# Altium project obc_ver2.PrjPcb (part 2 of 3)

## Sheet obc-v2_CM4-M2.SchDoc
size 420 x 297 mm; SheetNumber: 13; SheetTotal: 21
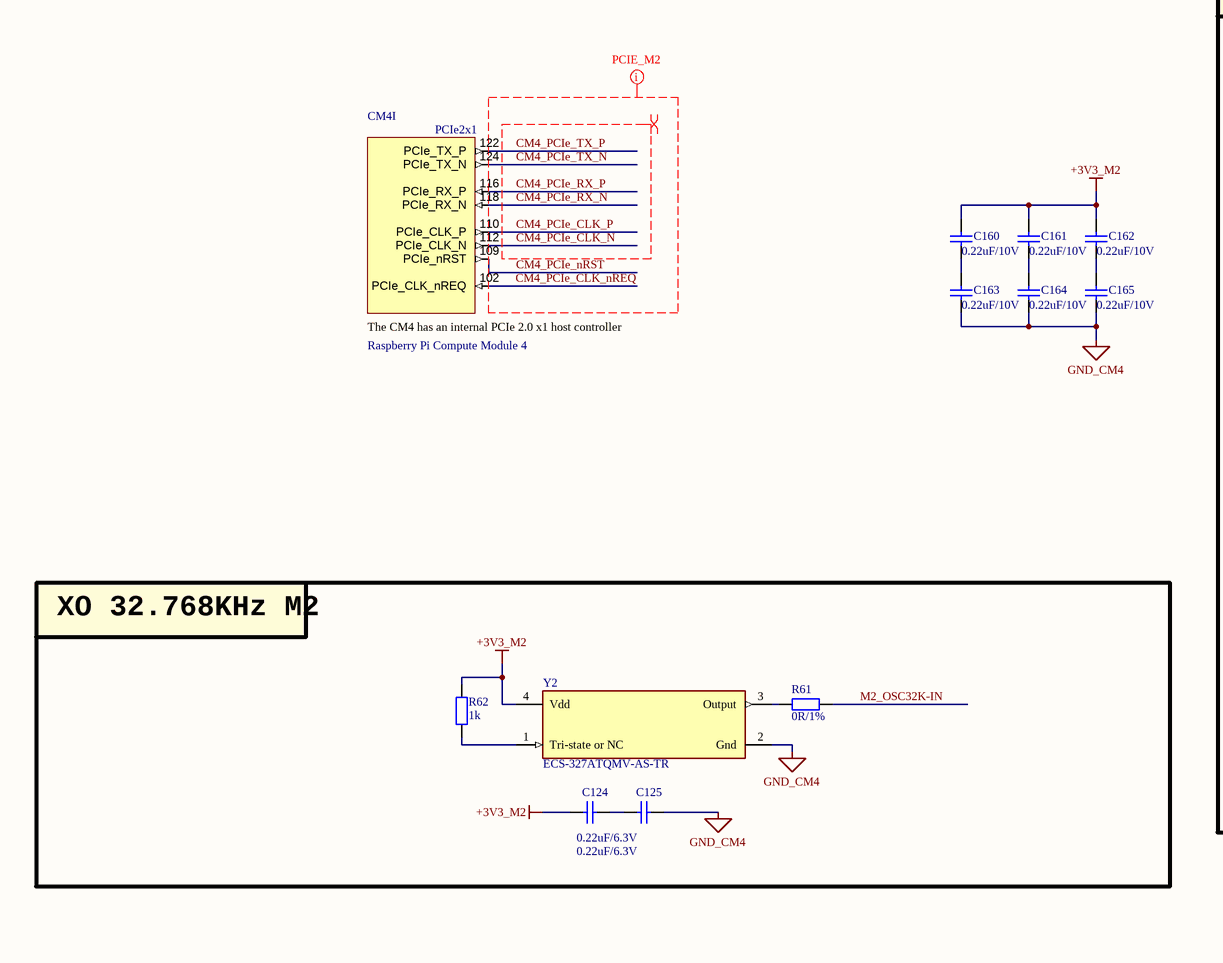
[diagram p13: obc-v2_CM4-M2.SchDoc, left]
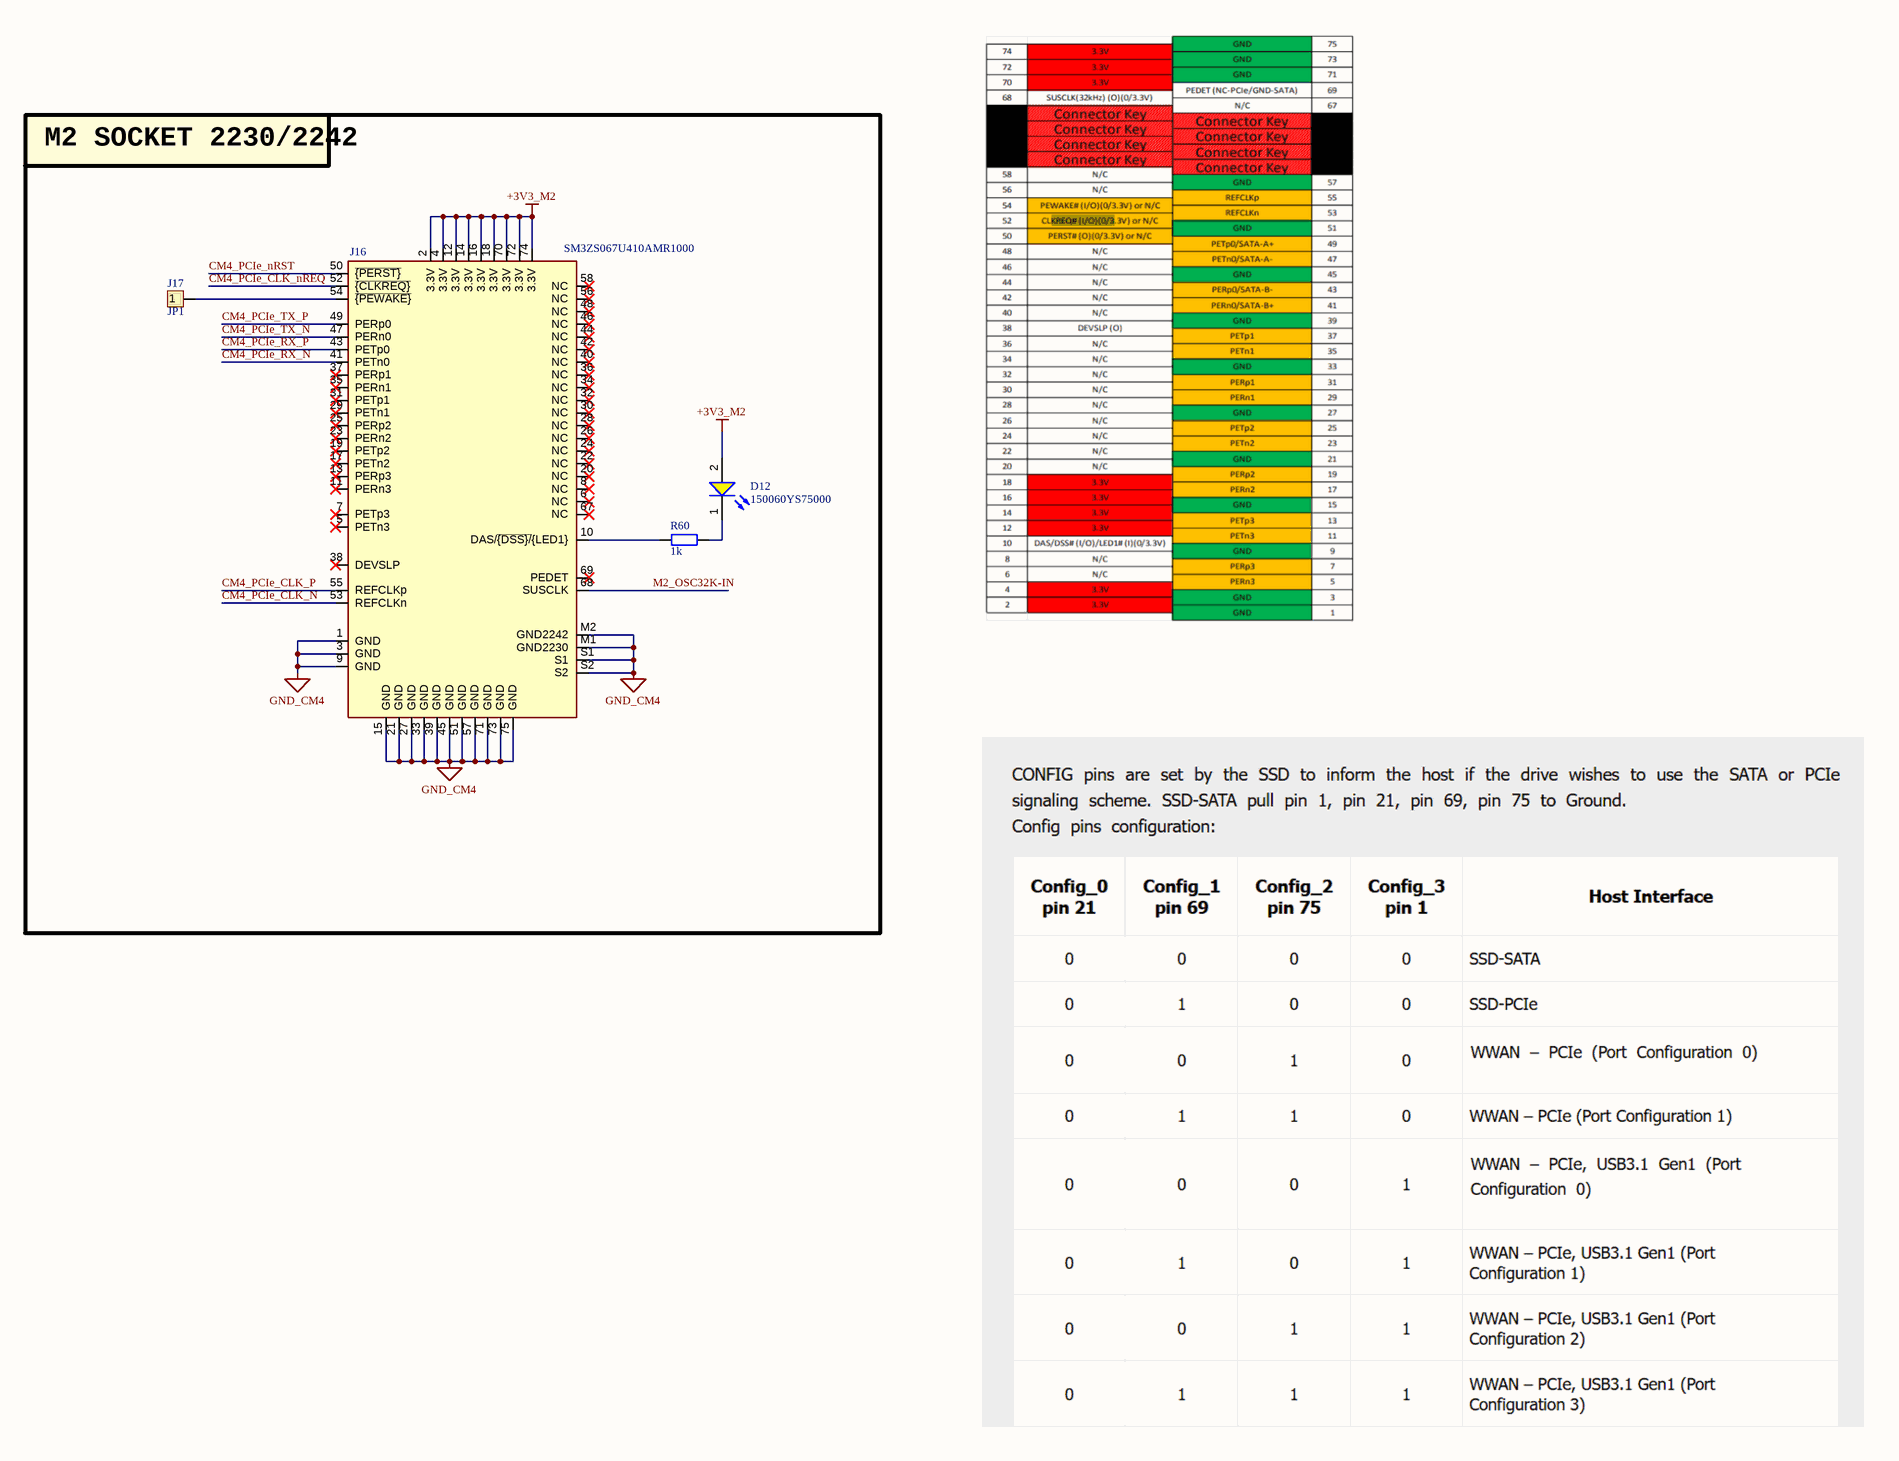
[diagram p14: obc-v2_CM4-M2.SchDoc, right]

### Parts
C124  0.22uF/6.3V  [CAP_C_1005X60]
C125  0.22uF/6.3V  [CAP_C_1005X60]
C160  0.22uF/10V  [CAP_C_1005X60]
C161  0.22uF/10V  [CAP_C_1005X60]
C162  0.22uF/10V  [CAP_C_1005X60]
C163  0.22uF/10V  [CAP_C_1005X60]
C164  0.22uF/10V  [CAP_C_1005X60]
C165  0.22uF/10V  [CAP_C_1005X60]
CM4  Raspberry Pi Compute Module 4  [CM4-DF40HC(3.0)-100DS-0.4v_3mm_1.5mm]  (part I of 21)  (no BOM)
D12  150060YS75000  [WL-SMCW_0603_150060xx75000]
J16  value SM3ZS067U410AMR1000  [M.2 M Key socket]  (hidden comment: Bus_M.2_Socket_M)
J17  JP1  [JP1-D1T]
R60  1k  [RES_C_1608X60]
R61  0R/1%  [RES_C_1608X60]
R62  1k  [RES_C_1608X60]
Y2  ECS-327ATQMV-AS-TR  [FP-327ATQMV-MFG]

### Blocks framed on the sheet
M2 SOCKET 2230/2242: D12 J16 J17 R60
XO 32.768KHz M2: C124 C125 R61 R62 Y2

### Nets
+3V3_M2: C124.1 C160.1 C161.1 C162.1 D12.2(A) J16.2(3.3V) J16.4(3.3V) J16.12(3.3V) J16.14(3.3V) J16.16(3.3V) J16.18(3.3V) J16.70(3.3V) J16.72(3.3V) J16.74(3.3V) R62.1 Y2.4(Vdd)
GND_CM4: C125.2 C163.2 C164.2 C165.2 J16.1(GND) J16.3(GND) J16.9(GND) J16.15(GND) J16.21(GND) J16.27(GND) J16.33(GND) J16.39(GND) J16.45(GND) J16.51(GND) J16.57(GND) J16.71(GND) J16.73(GND) J16.75(GND) J16.M1(GND2230) J16.M2(GND2242) J16.S1 J16.S2 Y2.2(Gnd)
CM4_PCIe_CLK_N: CM4.112(PCIe_CLK_N) J16.53(REFCLKn)
CM4_PCIe_CLK_nREQ: CM4.102(PCIe_CLK_nREQ) J16.52(~{{CLKREQ}})
CM4_PCIe_CLK_P: CM4.110(PCIe_CLK_P) J16.55(REFCLKp)
CM4_PCIe_nRST: CM4.109(PCIe_nRST) J16.50(~{{PERST}})
CM4_PCIe_RX_N: CM4.118(PCIe_RX_N) J16.41(PETn0)
CM4_PCIe_RX_P: CM4.116(PCIe_RX_P) J16.43(PETp0)
CM4_PCIe_TX_N: CM4.124(PCIe_TX_N) J16.47(PERn0)
CM4_PCIe_TX_P: CM4.122(PCIe_TX_P) J16.49(PERp0)
M2_OSC32K-IN: J16.68(SUSCLK) R61.1
NetC124_2: C124.2 C125.1
NetC160_2: C160.2 C163.1
NetC161_2: C161.2 C164.1
NetC162_2: C162.2 C165.1
NetD12_1: D12.1(K) R60.1
NetJ16_10: J16.10(DAS/~{{DSS}/}{LED1}) R60.2
NetJ16_54: J16.54(~{{PEWAKE}}) J17.1
NetR61_2: R61.2 Y2.3(Output)
NetR62_2: R62.2 Y2.1(Tri-state_or_NC)

Not connected (* = marked no-connect by the designer): J16 5(PETn3)* 6(NC)* 7(PETp3)* 8(NC)* 11(PERn3)* 13(PERp3)* 17(PETn2)* 19(PETp2)* 20(NC)* 22(NC)* 23(PERn2)* 24(NC)* 25(PERp2)* 26(NC)* 28(NC)* 29(PETn1)* 30(NC)* 31(PETp1)* 32(NC)* 34(NC)* 35(PERn1)* 36(NC)* 37(PERp1)* 38(DEVSLP)* 40(NC)* 42(NC)* 44(NC)* 46(NC)* 48(NC)* 56(NC)* 58(NC)* 67(NC)* 69(PEDET)*

### Layout directives
differential pair; differential pair class DIFF100: CM4_PCIe_CLK_N, CM4_PCIe_CLK_P, CM4_PCIe_RX_N, CM4_PCIe_RX_P, CM4_PCIe_TX_N, CM4_PCIe_TX_P
net class PCIE_M2: CM4_PCIe_CLK_N, CM4_PCIe_CLK_nREQ, CM4_PCIe_CLK_P, CM4_PCIe_nRST, CM4_PCIe_RX_N, CM4_PCIe_RX_P, CM4_PCIe_TX_N, CM4_PCIe_TX_P

### Notes on the sheet
- Project:
- Sub-system:
- Design by:
- Sheet title:
- Sheet
- A3
- of
- Checked by:
- Approved by:
- Revision:
- Document No:
- Size:
- Date:
- (in symbol CM4, part I) PCIe2x1; The CM4 has an internal PCIe 2.0 x1 host controller

### Library data of the parts
C124 C125 C160-C165 = Tu 0402 33nF 10V: as C1 on sheet obc-v2_POWER; Kieu_Chan: *
CM4 = CM4: Raspberry Pi Compute Module 4 by Amornthep Phunsin
D12 = CMP-1426-00005-2: as D1 on sheet obc-v2_POWER; Case Code (Imperial): 0603; Height: 700µm; REACH SVHC: Unknown; Dominant Wavelength: 590nm; Min Operating Temperature: -40°C; Color: Yellow; Width: 800µm; Mount: Surface Mount; Packaging: Tape and Reel; Max Operating Temperature: 85°C; RoHS: Compliant; Max Reverse Voltage (DC): 5V; Case Code (Metric): 1608; Length: 1.6mm; Case/Package: 0603
J16 = Bus_M.2_Socket_M: Part Description: M.2 M Key connector; Field5: MTSSD03-67MSW337; Field7: MTCONN; Field6: MTSSD03-67MSW337; Footprint: CM5IO:M.2 M Key socket
J17 = JP1: WR-PHD 2.54 mm Angled Socket Header; Manufacturer: W¨¹rth Elektronik eiSos GmbH; partNo: 613002143121; ComponentLink1 Description: Manufacturer; ComponentLink2 Description: Datasheet; NoPins: 02; Created Date: 29 March 2013; ComponentLink1URL: http://www.we-online.com; ComponentLink2URL: http://katalog.we-online.de/em/datasheet/6130xx143121.pdf; Created by: Karrer Zheng
R60-R62 = Tro 0603 1% 10k: as R1 on sheet obc-v2_POWER; Kieu_Chan: *
Y2 = CMP-40224-000027-1: XTAL OSC XO 32.7680KHZ CMOS SMD; RoHS Compliant: Yes

## Sheet obc-v2_CM4-PinOut.SchDoc
size 420 x 297 mm; SheetNumber: 14; SheetTotal: 21
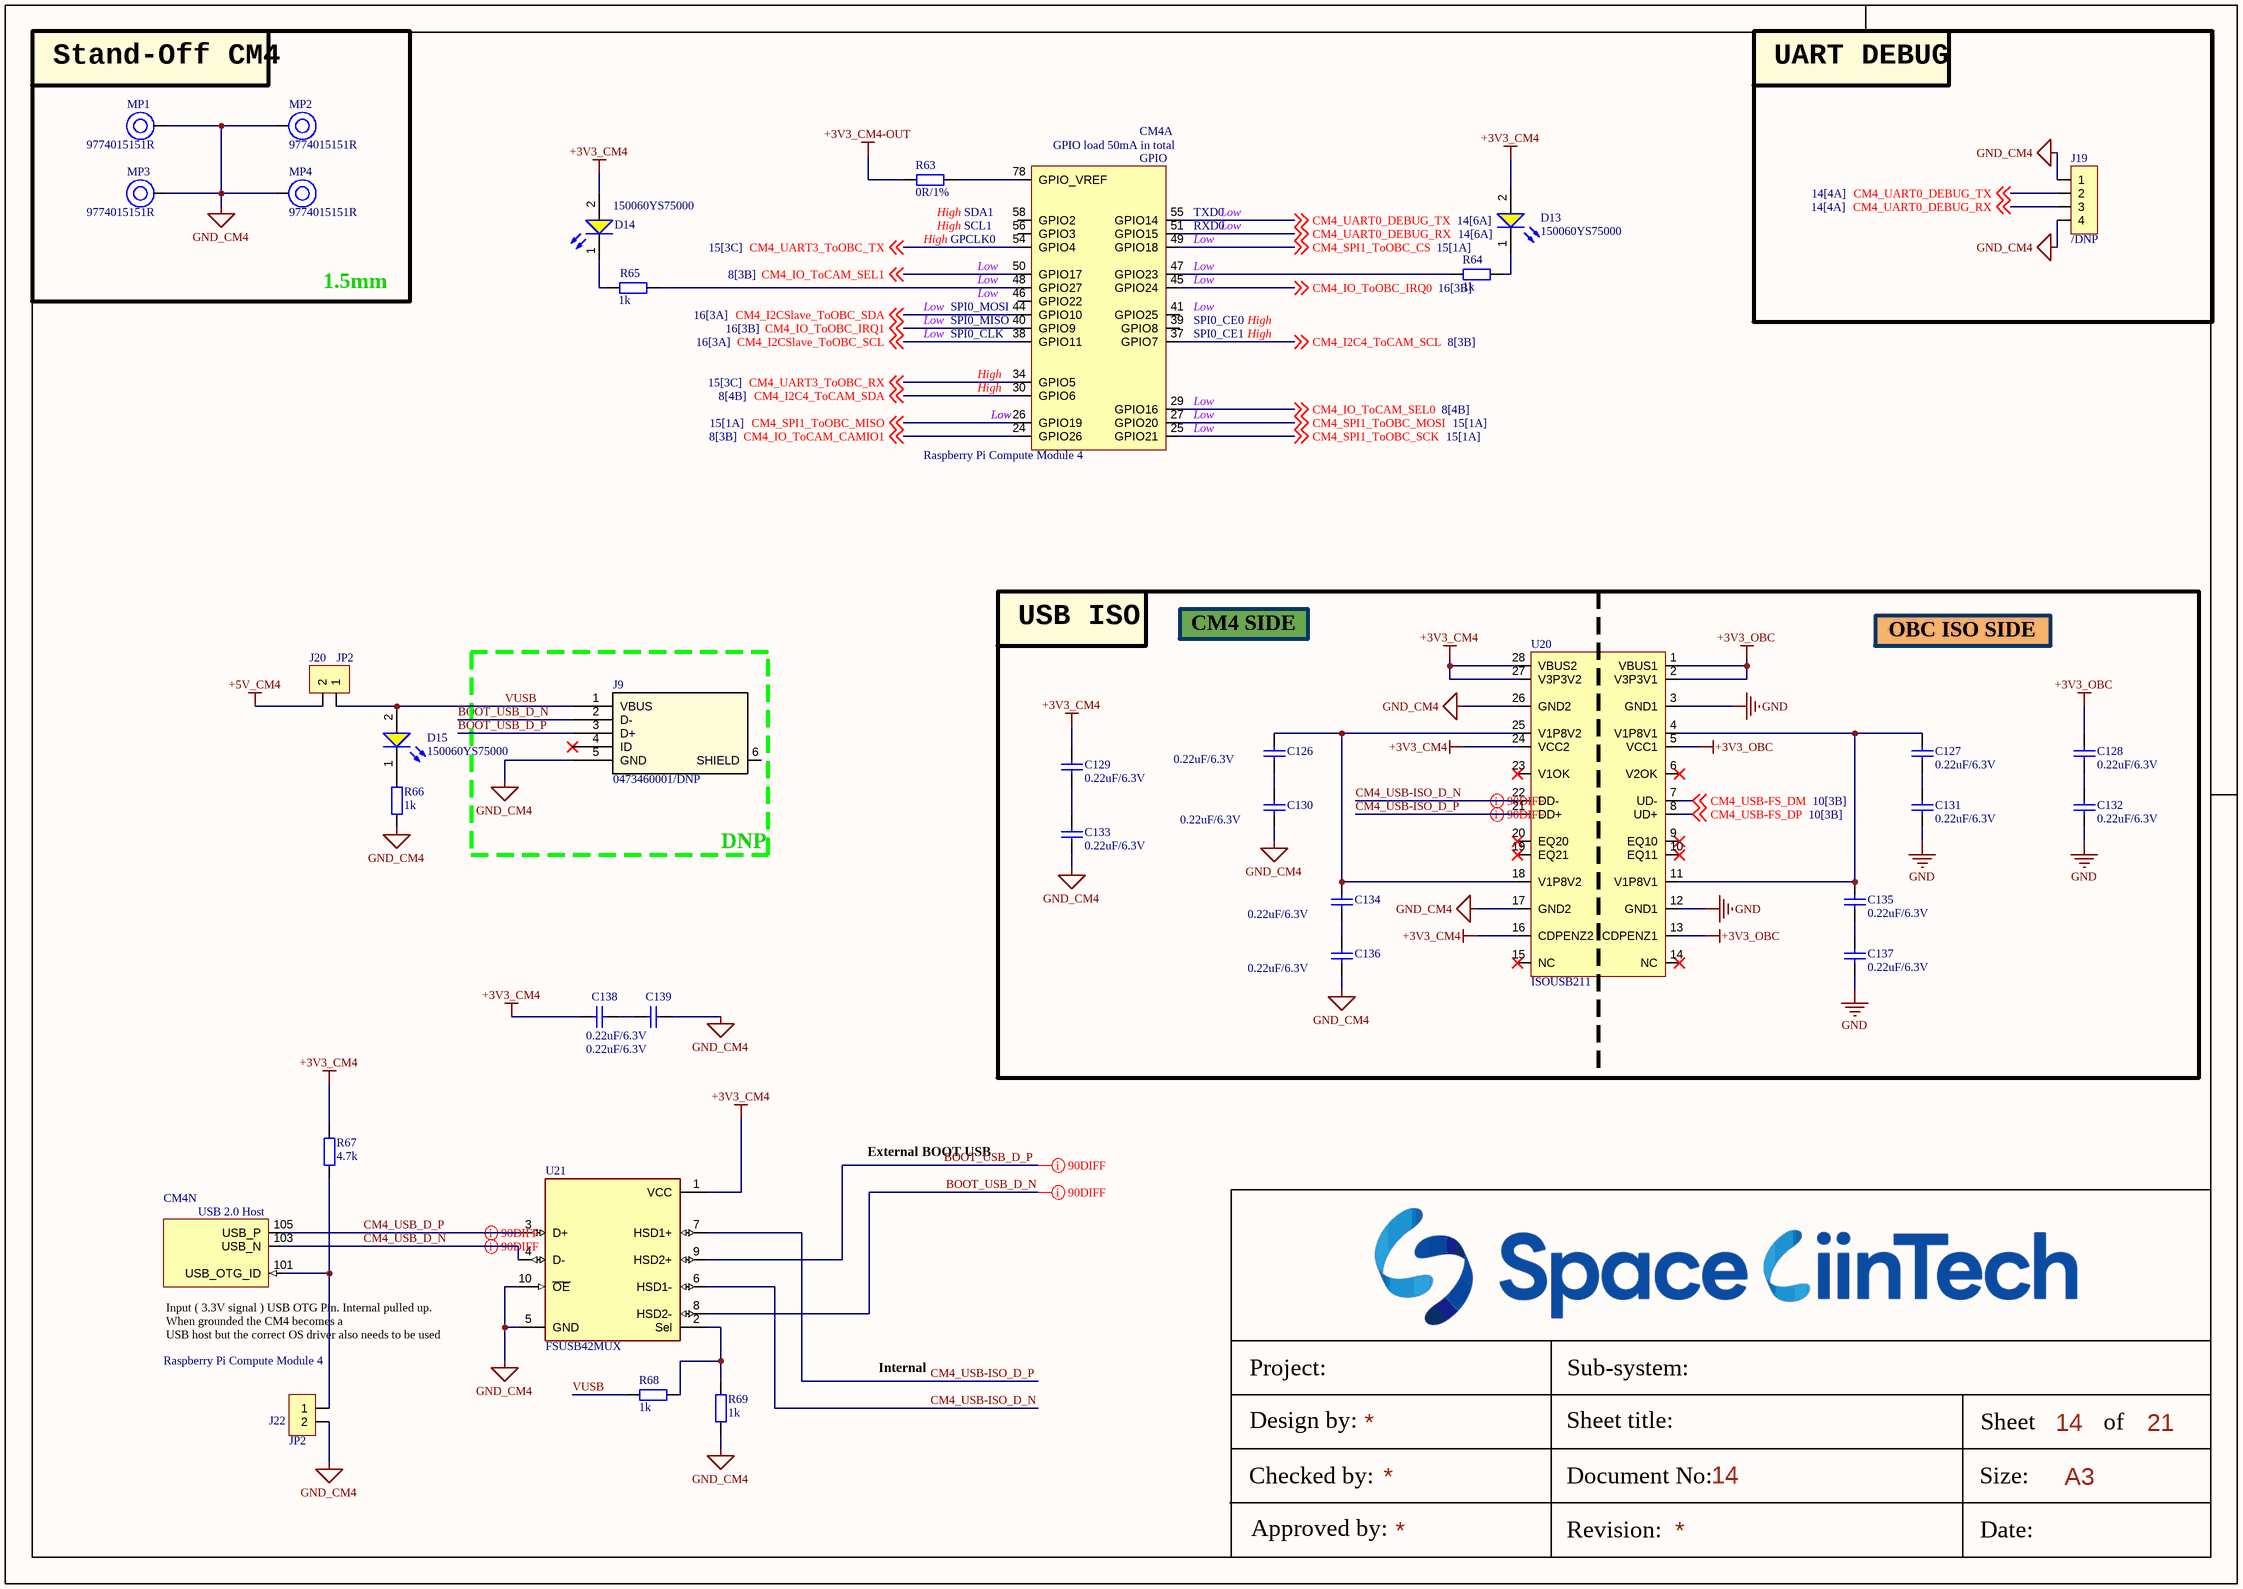
[diagram p15: obc-v2_CM4-PinOut.SchDoc]

### Parts
C126  0.22uF/6.3V  [CAP_C_1005X60]
C127  0.22uF/6.3V  [CAP_C_1005X60]
C128  0.22uF/6.3V  [CAP_C_1005X60]
C129  0.22uF/6.3V  [CAP_C_1005X60]
C130  0.22uF/6.3V  [CAP_C_1005X60]
C131  0.22uF/6.3V  [CAP_C_1005X60]
C132  0.22uF/6.3V  [CAP_C_1005X60]
C133  0.22uF/6.3V  [CAP_C_1005X60]
C134  0.22uF/6.3V  [CAP_C_1005X60]
C135  0.22uF/6.3V  [CAP_C_1005X60]
C136  0.22uF/6.3V  [CAP_C_1005X60]
C137  0.22uF/6.3V  [CAP_C_1005X60]
C138  0.22uF/6.3V  [CAP_C_1005X60]
C139  0.22uF/6.3V  [CAP_C_1005X60]
CM4  Raspberry Pi Compute Module 4  [CM4-DF40HC(3.0)-100DS-0.4v_3mm_1.5mm]  (parts A,N of 21)  (no BOM)
D13  150060YS75000  [WL-SMCW_0603_150060xx75000]
D14  150060YS75000  [WL-SMCW_0603_150060xx75000]
D15  150060YS75000  [WL-SMCW_0603_150060xx75000]
J9  0473460001/DNP  [47346-0001_MOL]
J19  /DNP  [JP4-C1T]
J20  JP2  [JP2-D1T]
J22  JP2  [JP2-D1T]
MP1  9774015151R  [9774015151]
MP2  9774015151R  [9774015151]
MP3  9774015151R  [9774015151]
MP4  9774015151R  [9774015151]
R63  0R/1%  [RES_C_1608X60]
R64  1k  [RES_C_1608X60]
R65  1k  [RES_C_1608X60]
R66  1k  [RES_C_1608X60]
R67  4.7k  [RES_C_1608X60]
R68  1k  [RES_C_1608X60]
R69  1k  [RES_C_1608X60]
U20  ISOUSB211  [BSSOP_65P_750W_28]
U21  FSUSB42MUX  [FP-846AP-MFG]

### Blocks framed on the sheet
Stand-Off CM4: MP1-MP4
UART DEBUG: J19
USB ISO: C126-C137 U20
DNP: J9

### Nets
+3V3_CM4: C129.1 C138.1 D13.2(A) D14.2(A) R67.1 U20.16(CDPENZ2) U20.24(VCC2) U20.27(V3P3V2) U20.28(VBUS2) U21.1(VCC)
+3V3_CM4-OUT: R63.1
+3V3_OBC: C128.1 U20.1(VBUS1) U20.2(V3P3V1) U20.5(VCC1) U20.13(CDPENZ1)
+5V_CM4: J20.2  [project net +5V_AUX-Adaptor]
GND: C131.2 C132.2 C137.2 U20.3(GND1) U20.12(GND1)
GND_CM4: C130.2 C133.2 C136.2 C139.2 J9.5(GND) J19.1 J19.4 J22.2 MP1.1 MP2.1 MP3.1 MP4.1 R66.2 R69.2 U20.17(GND2) U20.26(GND2) U21.5(GND) U21.10(~{OE})
BOOT_USB_D_N: J9.2(D-) U21.8(HSD2-)
BOOT_USB_D_P: J9.3(D+) U21.9(HSD2+)
CM4_I2C4_ToCAM_SCL: CM4.37(GPIO7) ; off-sheet CM4_I2C4_ToCAM_SCL
CM4_I2C4_ToCAM_SDA: CM4.30(GPIO6) ; off-sheet CM4_I2C4_ToCAM_SDA
CM4_I2CSlave_ToOBC_SCL: CM4.38(GPIO11) ; off-sheet CM4_I2CSlave_ToOBC_SCL
CM4_I2CSlave_ToOBC_SDA: CM4.44(GPIO10) ; off-sheet CM4_I2CSlave_ToOBC_SDA
CM4_IO_ToCAM_CAMIO1: CM4.24(GPIO26) ; off-sheet CM4_IO_ToCAM_CAMIO1
CM4_IO_ToCAM_SEL0: CM4.29(GPIO16) ; off-sheet CM4_IO_ToCAM_SEL0
CM4_IO_ToCAM_SEL1: CM4.50(GPIO17) ; off-sheet CM4_IO_ToCAM_SEL1
CM4_IO_ToOBC_IRQ0: CM4.45(GPIO24) ; off-sheet CM4_IO_ToOBC_IRQ0
CM4_IO_ToOBC_IRQ1: CM4.40(GPIO9) ; off-sheet CM4_IO_ToOBC_IRQ1
CM4_SPI1_ToOBC_CS: CM4.49(GPIO18) ; off-sheet CM4_SPI1_ToOBC_CS  [project net CM4_SPI1_ISO_CS]
CM4_SPI1_ToOBC_MISO: CM4.26(GPIO19) ; off-sheet CM4_SPI1_ToOBC_MISO  [project net CM4_SPI1_ISO_MISO]
CM4_SPI1_ToOBC_MOSI: CM4.27(GPIO20) ; off-sheet CM4_SPI1_ToOBC_MOSI  [project net CM4_SPI1_ISO_MOSI]
CM4_SPI1_ToOBC_SCK: CM4.25(GPIO21) ; off-sheet CM4_SPI1_ToOBC_SCK  [project net CM4_SPI1_ISO_SCK]
CM4_UART0_DEBUG_RX: CM4.51(GPIO15) J19.3 ; off-sheet CM4_UART0_DEBUG_RX
CM4_UART0_DEBUG_TX: CM4.55(GPIO14) J19.2 ; off-sheet CM4_UART0_DEBUG_TX
CM4_UART3_ToOBC_RX: CM4.34(GPIO5) ; off-sheet CM4_UART3_ToOBC_RX
CM4_UART3_ToOBC_TX: CM4.54(GPIO4) ; off-sheet CM4_UART3_ToOBC_TX
CM4_USB-FS_DM: U20.7(UD-) ; off-sheet CM4_USB-FS_DM  [project net CM4_USB-FS_HUB_D_N]
CM4_USB-FS_DP: U20.8(UD+) ; off-sheet CM4_USB-FS_DP  [project net CM4_USB-FS_HUB_D_P]
CM4_USB-ISO_D_N: U20.22(DD-) U21.6(HSD1-)
CM4_USB-ISO_D_P: U20.21(DD+) U21.7(HSD1+)
CM4_USB_D_N: CM4.103(USB_N) U21.4(D-)
CM4_USB_D_P: CM4.105(USB_P) U21.3(D+)
VUSB: D15.2(A) J9.1(VBUS) J20.1 R68.1
NetC126_1: C126.1 C134.1 U20.18(V1P8V2) U20.25(V1P8V2)
NetC126_2: C126.2 C130.1
NetC127_1: C127.1 C135.1 U20.4(V1P8V1) U20.11(V1P8V1)
NetC127_2: C127.2 C131.1
NetC128_2: C128.2 C132.1
NetC129_2: C129.2 C133.1
NetC134_2: C134.2 C136.1
NetC135_2: C135.2 C137.1
NetC138_2: C138.2 C139.1
NetCM4_47: CM4.47(GPIO23) R64.2
NetCM4_48: CM4.48(GPIO27) R65.2
NetCM4_78: CM4.78(GPIO_VREF) R63.2
NetCM4_101: CM4.101(USB_OTG_ID) J22.1 R67.2
NetD13_1: D13.1(K) R64.1
NetD14_1: D14.1(K) R65.1
NetD15_1: D15.1(K) R66.1
NetR68_2: R68.2 R69.1 U21.2(Sel)

Not connected (* = marked no-connect by the designer): CM4 39(GPIO8) 41(GPIO25) 46(GPIO22) 56(GPIO3) 58(GPIO2); J9 4(ID)* 6(SHIELD); U20 6(V2OK)* 9(EQ10)* 10(EQ11)* 14(NC)* 15(NC)* 19(EQ21)* 20(EQ20)* 23(V1OK)*

### Layout directives
differential pair; differential pair class DIFF90: BOOT_USB_D_N, BOOT_USB_D_P, CM4_USB-ISO_D_N, CM4_USB-ISO_D_P, CM4_USB_D_N, CM4_USB_D_P

### Notes on the sheet
- 1.5mm
- CM4 SIDE
- OBC ISO SIDE
- External BOOT USB
- Internal
- Project:
- Sub-system:
- Design by:
- Sheet title:
- Sheet
- A3
- of
- Checked by:
- Approved by:
- Revision:
- Document No:
- Size:
- Date:
- (in symbol CM4, part A) GPIO load 50mA in total; GPIO; High; SDA1; TXD0; Low; SCL1; RXD0; GPCLK0; SPI0_MOSI; SPI0_MISO; SPI0_CE0; SPI0_CLK; SPI0_CE1; by Amornthep Phunsin
- (in symbol CM4, part N) USB 2.0 Host; Input ( 3.3V signal ) USB OTG Pin. Internal pulled up. When grounded the CM4 becomes a / USB host but the correct OS driver also needs to be used

### Library data of the parts
C126-C139 = Tu 0402 33nF 10V: as C1 on sheet obc-v2_POWER; Kieu_Chan: *
CM4 = CM4: as CM4 on sheet obc-v2_CM4-M2
D13-D15 = CMP-1426-00005-2: as D1 on sheet obc-v2_POWER; Case Code (Imperial): 0603; Height: 700µm; REACH SVHC: Unknown; Dominant Wavelength: 590nm; Min Operating Temperature: -40°C; Color: Yellow; Width: 800µm; Mount: Surface Mount; Packaging: Tape and Reel; Max Operating Temperature: 85°C; RoHS: Compliant; Max Reverse Voltage (DC): 5V; Case Code (Metric): 1608; Length: 1.6mm; Case/Package: 0603
J9 = USB_micro: No Description Available; Mfr_Name: Molex Connector Corporation; RefDes: RefDes; Type: Type
J19 = JP4: WR-PHD 2.54 mm Angled Socket Header; Manufacturer: W¨¹rth Elektronik eiSos GmbH; partNo: 613004143121; ComponentLink1 Description: Manufacturer; ComponentLink2 Description: Datasheet; NoPins: 04; Created Date: 29 March 2013; ComponentLink1URL: http://www.we-online.com; ComponentLink2URL: http://katalog.we-online.de/em/datasheet/6130xx143121.pdf; Created by: Karrer Zheng
J20 J22 = JP2: as J15 on sheet obc-v2_EXP-CAN-RS422; Created Date: 29 March 2013; ComponentLink1URL: http://www.we-online.com; ComponentLink2URL: http://katalog.we-online.de/em/datasheet/6130xx143121.pdf; Created by: Karrer Zheng
MP1-MP4 = CMP-03913-59774846-1: 9774015151R WA-SMSI SMT Steel Spacer, M2.5 Internal non Stop; Plating: Tin; Outside Diameter: 5.1054mm; Threaded/Unthreaded: Threaded; Length: 1.5mm; Packaging: Tape and Reel; NexarPartId: 59774846; Min Operating Temperature: -55°C; Height: 1.6mm; Material: Steel; REACH SVHC: Unknown; Max Operating Temperature: 150°C; RoHS: Compliant
R63-R69 = Tro 0603 1% 10k: as R1 on sheet obc-v2_POWER; Kieu_Chan: *
U21 = CMP-07103-000004-1: IC USB SWITCH DPDT 10MSOP; Voltage: 4.3V; Current: 100mA; Number of Inputs: 2; Supply Type: Single; Number of Outputs: 4; Data Rate: 480Mbps; On-State Resistance: 6.5R; Min Supply Voltage: 3V; Package Quantity: 1; Length: 3mm; Radiation Hardening: No; Number of Pins: 10; Width: 3mm; Number of Channels: 2; REACH SVHC: No SVHC; Lead Free: Lead Free; Max Operating Temperature: 85°C; Min Operating Temperature: -40°C; Packaging: Tape and Reel; Throw Configuration: DPDT; Operating Supply Voltage: 4.3V; Max Supply Voltage: 4.3V; Mount: Surface Mount; Case/Package: MSOP; Weight: 0.1125g; Height: 0.85mm

## Sheet obc-v2_CM4-SPI-UART.SchDoc
size 420 x 297 mm; SheetNumber: 15; SheetTotal: 21
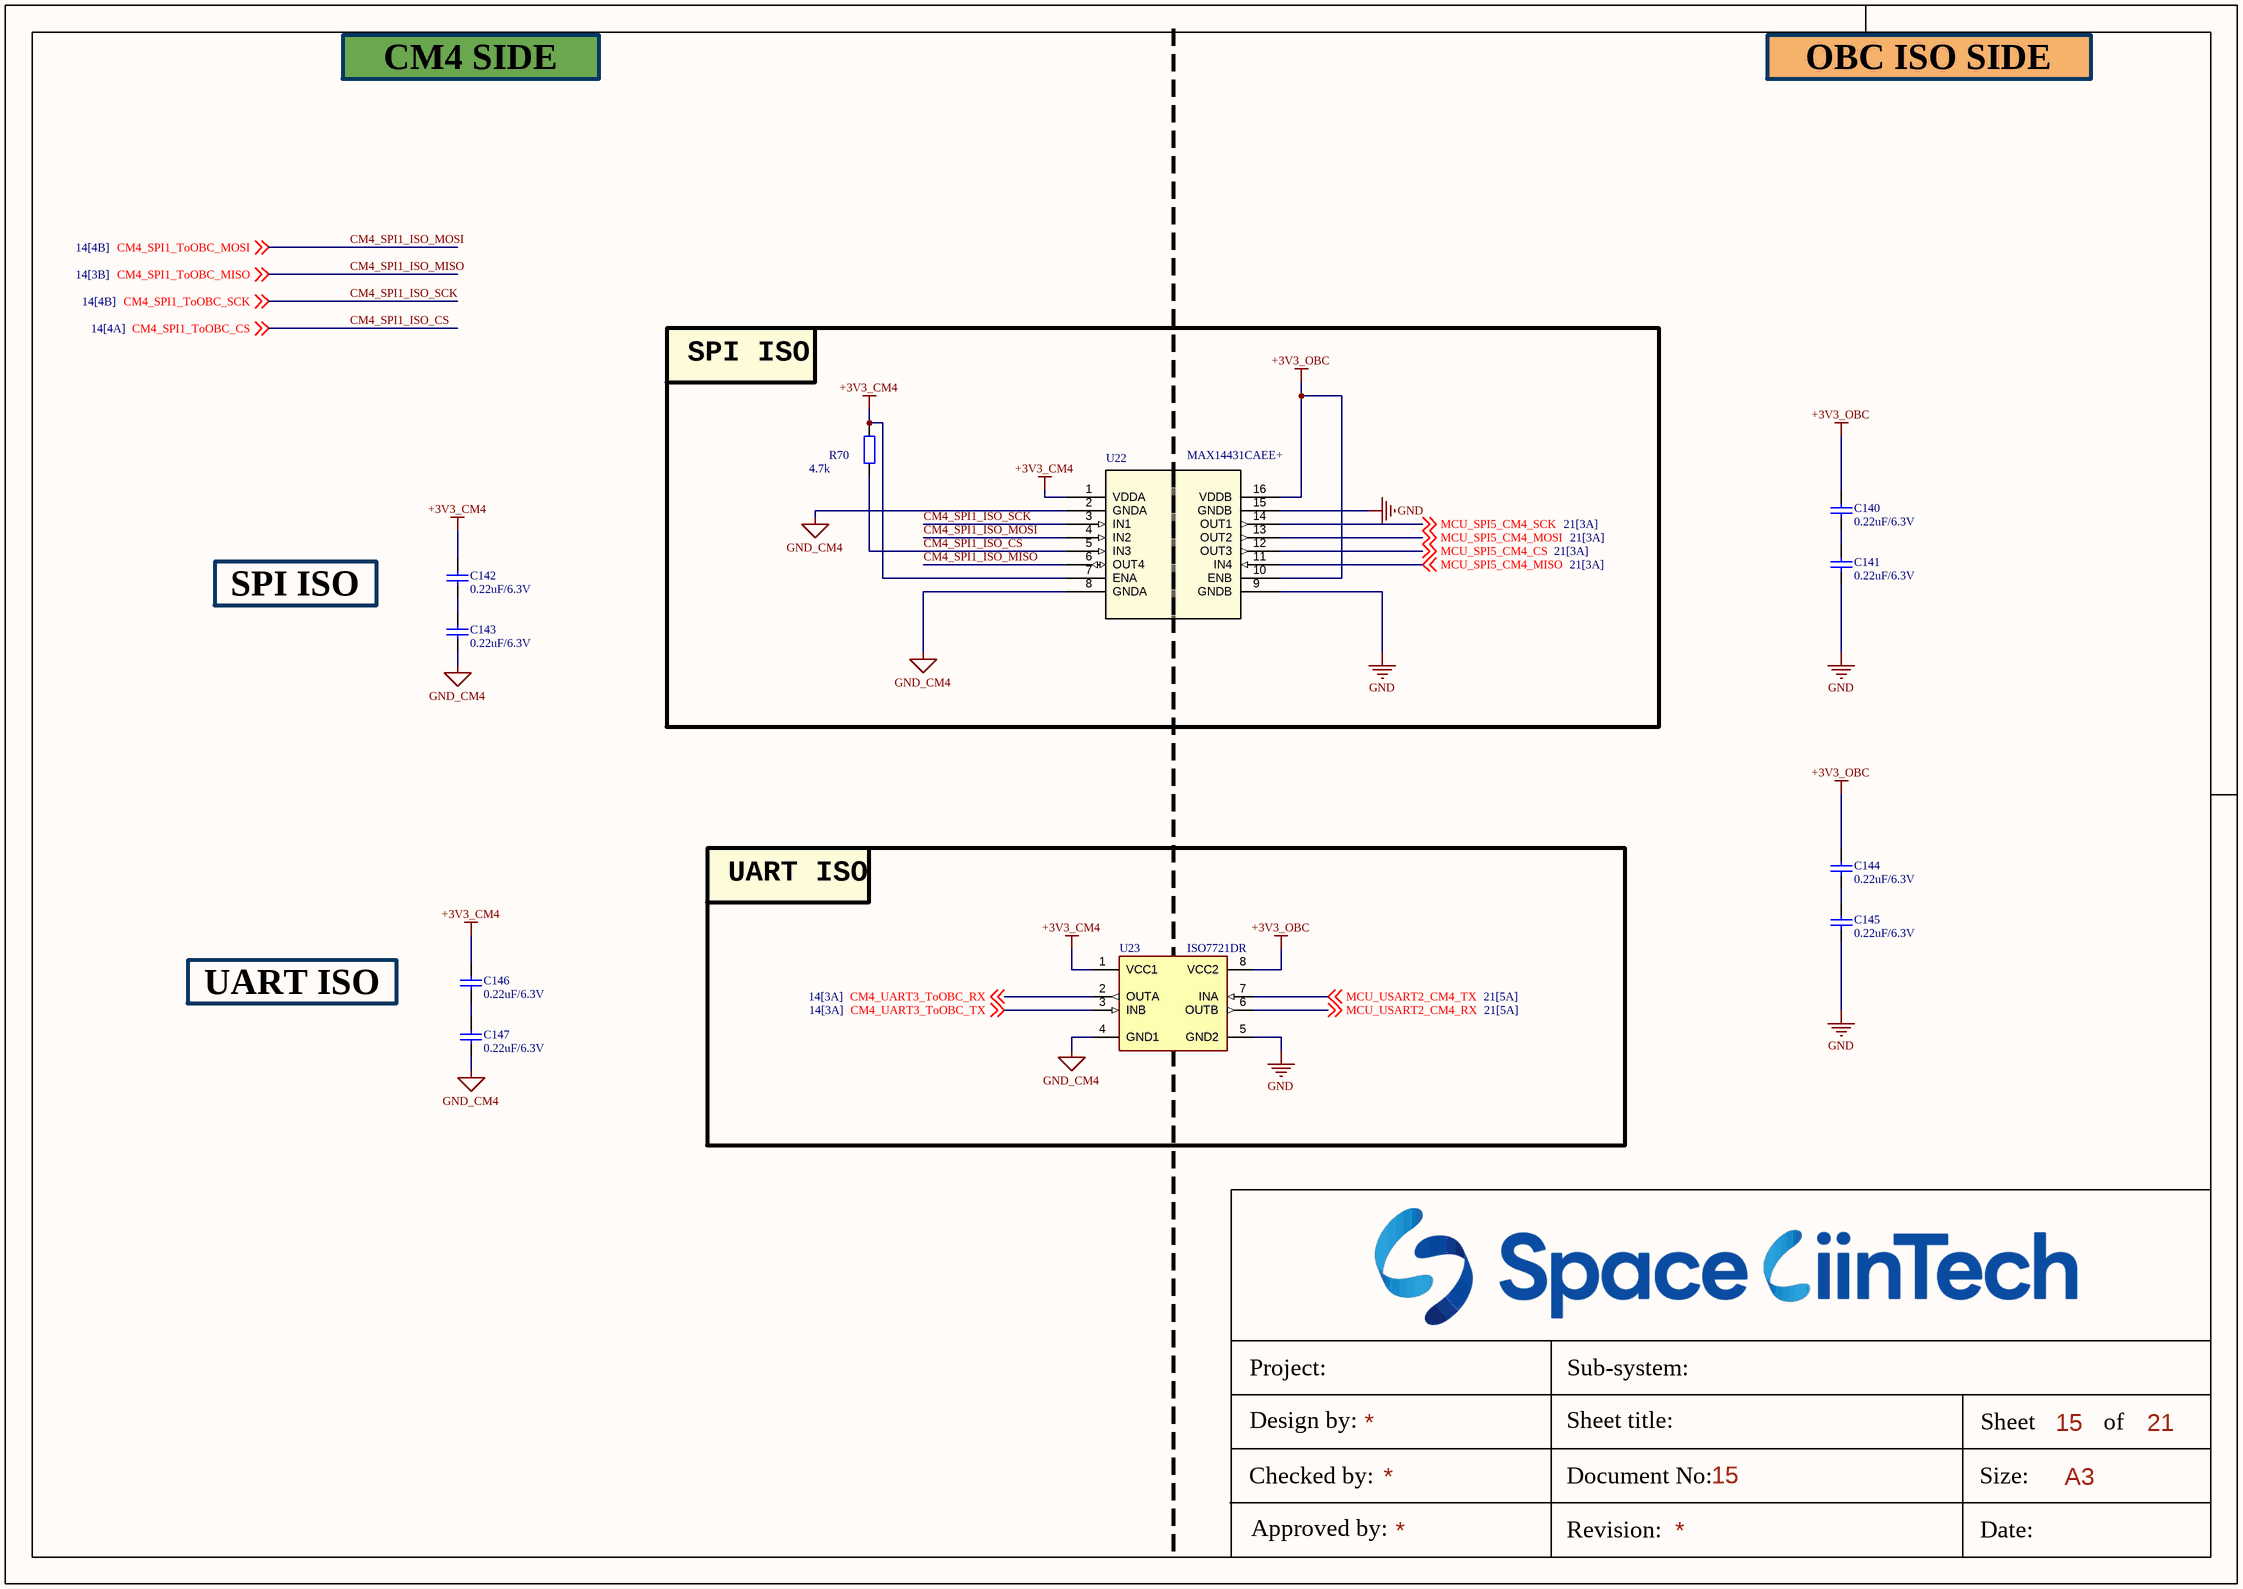
[diagram p16: obc-v2_CM4-SPI-UART.SchDoc]

### Parts
C140  0.22uF/6.3V  [CAP_C_1005X60]
C141  0.22uF/6.3V  [CAP_C_1005X60]
C142  0.22uF/6.3V  [CAP_C_1005X60]
C143  0.22uF/6.3V  [CAP_C_1005X60]
C144  0.22uF/6.3V  [CAP_C_1005X60]
C145  0.22uF/6.3V  [CAP_C_1005X60]
C146  0.22uF/6.3V  [CAP_C_1005X60]
C147  0.22uF/6.3V  [CAP_C_1005X60]
R70  4.7k  [RES_C_1608X60]
U22  MAX14431CAEE+  [21-0055Q_E16MS+1F_MXM]
U23  ISO7721DR  [SOIC127P602X173-8N]

### Blocks framed on the sheet
SPI ISO: R70 U22
UART ISO: U23

### Nets
+3V3_CM4: C142.1 C146.1 R70.2 U22.1(VDDA) U22.7(ENA) U23.1(VCC1)
+3V3_OBC: C140.2 C144.2 U22.10(ENB) U22.16(VDDB) U23.8(VCC2)
GND: C141.1 C145.1 U22.9(GNDB) U22.15(GNDB) U23.5(GND2)
GND_CM4: C143.2 C147.2 U22.2(GNDA) U22.8(GNDA) U23.4(GND1)
CM4_SPI1_ISO_CS: R70.1 U22.5(IN3) ; off-sheet CM4_SPI1_ToOBC_CS  [also labelled CM4_SPI1_ToOBC_CS]
CM4_SPI1_ISO_MISO: U22.6(OUT4) ; off-sheet CM4_SPI1_ToOBC_MISO  [also labelled CM4_SPI1_ToOBC_MISO]
CM4_SPI1_ISO_MOSI: U22.4(IN2) ; off-sheet CM4_SPI1_ToOBC_MOSI  [also labelled CM4_SPI1_ToOBC_MOSI]
CM4_SPI1_ISO_SCK: U22.3(IN1) ; off-sheet CM4_SPI1_ToOBC_SCK  [also labelled CM4_SPI1_ToOBC_SCK]
CM4_UART3_ToOBC_RX: U23.2(OUTA) ; off-sheet CM4_UART3_ToOBC_RX
CM4_UART3_ToOBC_TX: U23.3(INB) ; off-sheet CM4_UART3_ToOBC_TX
MCU_SPI5_CM4_CS: U22.12(OUT3) ; off-sheet MCU_SPI5_CM4_CS
MCU_SPI5_CM4_MISO: U22.11(IN4) ; off-sheet MCU_SPI5_CM4_MISO
MCU_SPI5_CM4_MOSI: U22.13(OUT2) ; off-sheet MCU_SPI5_CM4_MOSI
MCU_SPI5_CM4_SCK: U22.14(OUT1) ; off-sheet MCU_SPI5_CM4_SCK
MCU_USART2_CM4_RX: U23.6(OUTB) ; off-sheet MCU_USART2_CM4_RX
MCU_USART2_CM4_TX: U23.7(INA) ; off-sheet MCU_USART2_CM4_TX
NetC140_1: C140.1 C141.2
NetC142_2: C142.2 C143.1
NetC144_1: C144.1 C145.2
NetC146_2: C146.2 C147.1

### Notes on the sheet
- CM4 SIDE
- OBC ISO SIDE
- SPI ISO
- UART ISO
- Project:
- Sub-system:
- Design by:
- Sheet title:
- Sheet
- A3
- of
- Checked by:
- Approved by:
- Revision:
- Document No:
- Size:
- Date:

### Library data of the parts
C140-C147 = Tu 0402 33nF 10V: as C1 on sheet obc-v2_POWER; Kieu_Chan: *
R70 = Tro 0603 1% 10k: as R1 on sheet obc-v2_POWER; Kieu_Chan: *
U22 = MAX14431CAEE+: No Description Available; Mfr_Name: Analog Devices / Maxim Integrated; RefDes: RefDes; Type: Type
U23 = ISO7721DR: Robust EMC, dual-channel, 1/1, reinforced digital isolator 8-SOIC -55 to 125; Package: None; Value: *; MP: ISO7721DR; Availability: Unavailable; Price: None

## Sheet obc-v2_CM4-IRQ-CTRL.SchDoc
size 420 x 297 mm; SheetNumber: 18; SheetTotal: 23
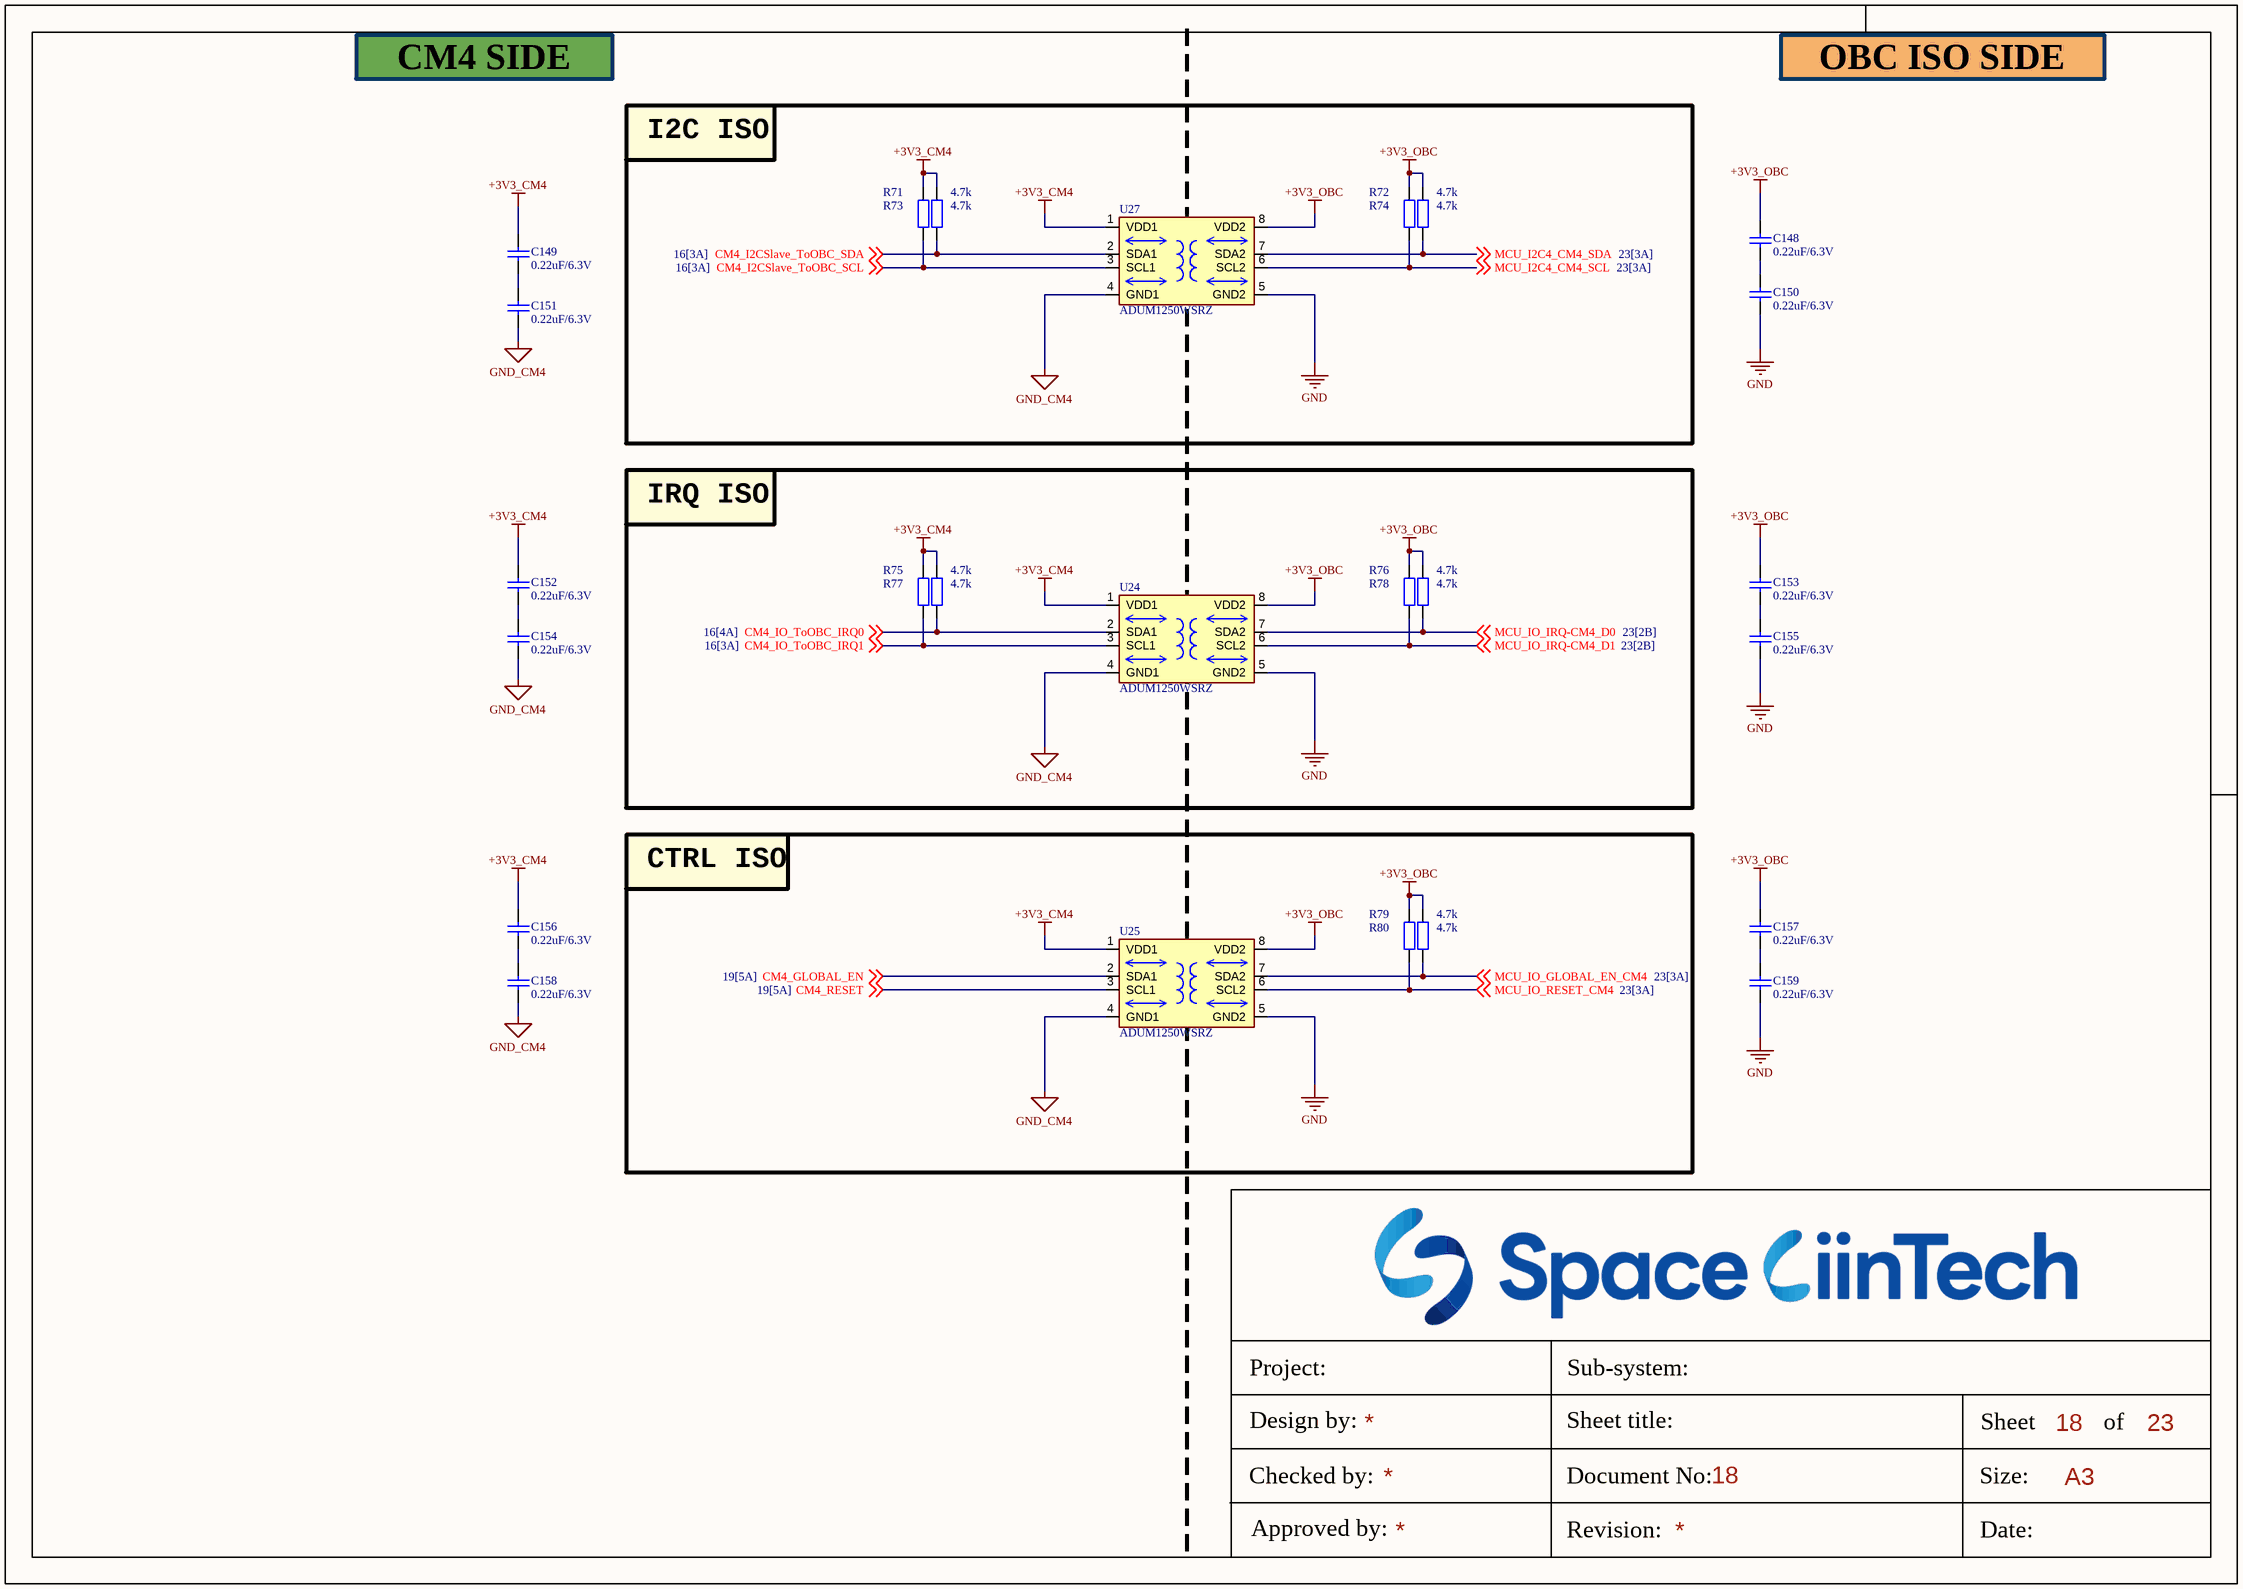
[diagram p17: obc-v2_CM4-IRQ-CTRL.SchDoc]

### Parts
C148  0.22uF/6.3V  [CAP_C_1005X60]
C149  0.22uF/6.3V  [CAP_C_1005X60]
C150  0.22uF/6.3V  [CAP_C_1005X60]
C151  0.22uF/6.3V  [CAP_C_1005X60]
C152  0.22uF/6.3V  [CAP_C_1005X60]
C153  0.22uF/6.3V  [CAP_C_1005X60]
C154  0.22uF/6.3V  [CAP_C_1005X60]
C155  0.22uF/6.3V  [CAP_C_1005X60]
C156  0.22uF/6.3V  [CAP_C_1005X60]
C157  0.22uF/6.3V  [CAP_C_1005X60]
C158  0.22uF/6.3V  [CAP_C_1005X60]
C159  0.22uF/6.3V  [CAP_C_1005X60]
R71  4.7k  [RES_C_1608X60]
R72  4.7k  [RES_C_1608X60]
R73  4.7k  [RES_C_1608X60]
R74  4.7k  [RES_C_1608X60]
R75  4.7k  [RES_C_1608X60]
R76  4.7k  [RES_C_1608X60]
R77  4.7k  [RES_C_1608X60]
R78  4.7k  [RES_C_1608X60]
R79  4.7k  [RES_C_1608X60]
R80  4.7k  [RES_C_1608X60]
U24  ADUM1250WSRZ  [SOIC127P602X173-8N]
U25  ADUM1250WSRZ  [SOIC127P602X173-8N]
U27  ADUM1250WSRZ  [SOIC127P602X173-8N]

### Blocks framed on the sheet
I2C ISO: R71-R74 U27
IRQ ISO: R75-R78 U24
CTRL ISO: R79 R80 U25

### Nets
+3V3_CM4: C149.1 C152.1 C156.1 R71.2 R73.2 R75.2 R77.2 U24.1(VDD1) U25.1(VDD1) U27.1(VDD1)
+3V3_OBC: C148.1 C153.1 C157.1 R72.2 R74.2 R76.2 R78.2 R79.2 R80.2 U24.8(VDD2) U25.8(VDD2) U27.8(VDD2)
GND: C150.2 C155.2 C159.2 U24.5(GND2) U25.5(GND2) U27.5(GND2)
GND_CM4: C151.2 C154.2 C158.2 U24.4(GND1) U25.4(GND1) U27.4(GND1)
CM4_GLOBAL_EN: U25.2(SDA1) ; off-sheet CM4_GLOBAL_EN  [project net CM4_ENABLE]
CM4_I2CSlave_ToOBC_SCL: R71.1 U27.3(SCL1) ; off-sheet CM4_I2CSlave_ToOBC_SCL
CM4_I2CSlave_ToOBC_SDA: R73.1 U27.2(SDA1) ; off-sheet CM4_I2CSlave_ToOBC_SDA
CM4_IO_ToOBC_IRQ0: R77.1 U24.2(SDA1) ; off-sheet CM4_IO_ToOBC_IRQ0
CM4_IO_ToOBC_IRQ1: R75.1 U24.3(SCL1) ; off-sheet CM4_IO_ToOBC_IRQ1
CM4_RESET: U25.3(SCL1) ; off-sheet CM4_RESET
MCU_I2C4_CM4_SCL: R72.1 U27.6(SCL2) ; off-sheet MCU_I2C4_CM4_SCL
MCU_I2C4_CM4_SDA: R74.1 U27.7(SDA2) ; off-sheet MCU_I2C4_CM4_SDA
MCU_IO_GLOBAL_EN_CM4: R80.1 U25.7(SDA2) ; off-sheet MCU_IO_GLOBAL_EN_CM4
MCU_IO_IRQ-CM4_D0: R78.1 U24.7(SDA2) ; off-sheet MCU_IO_IRQ-CM4_D0
MCU_IO_IRQ-CM4_D1: R76.1 U24.6(SCL2) ; off-sheet MCU_IO_IRQ-CM4_D1
MCU_IO_RESET_CM4: R79.1 U25.6(SCL2) ; off-sheet MCU_IO_RESET_CM4
NetC148_2: C148.2 C150.1
NetC149_2: C149.2 C151.1
NetC152_2: C152.2 C154.1
NetC153_2: C153.2 C155.1
NetC156_2: C156.2 C158.1
NetC157_2: C157.2 C159.1

### Notes on the sheet
- CM4 SIDE
- OBC ISO SIDE
- Project:
- Sub-system:
- Design by:
- Sheet title:
- Sheet
- A3
- of
- Checked by:
- Approved by:
- Revision:
- Document No:
- Size:
- Date:

### Library data of the parts
C148-C159 = Tu 0402 33nF 10V: CAPC; Chung_Loai: Dán; Don_Vi: Con; So_Chan: 2; Ten_Linh_Kien: Tụ 0402 33nF X7R 10V GRM155R71A333KA01D; Ma_Hang: MH007853; Kieu_Chan: *
R71-R80 = Tro 0603 1% 10k: RES; Chung_Loai: Dán; Don_Vi: Con; So_Chan: 2; Ten_Linh_Kien: Trở 0603 1% 10k; Ma_Hang: MH006333; Kieu_Chan: *
U24 U25 U27 = ADUM1250: IÂ²C Digital Isolator 2500Vrms 2 Channel 1Mbps 25kV/Âµs CMTI 8-SOIC (0.154", 3.90mm Width); MF: Analog Devices; Package: SOIC-8; Price: None; Value: *; SnapEDA_Link: https://www.snapeda.com/parts/ADUM1250/Analog+Devices/view-part/?ref=snap; MP: ADUM1250; Availability: Unavailable; Check_prices: https://www.snapeda.com/parts/ADUM1250/Analog+Devices/view-part/?ref=eda

## Sheet obc-v2_CM4-FUNCTION.SchDoc
size 420 x 297 mm; SheetNumber: 17; SheetTotal: 21
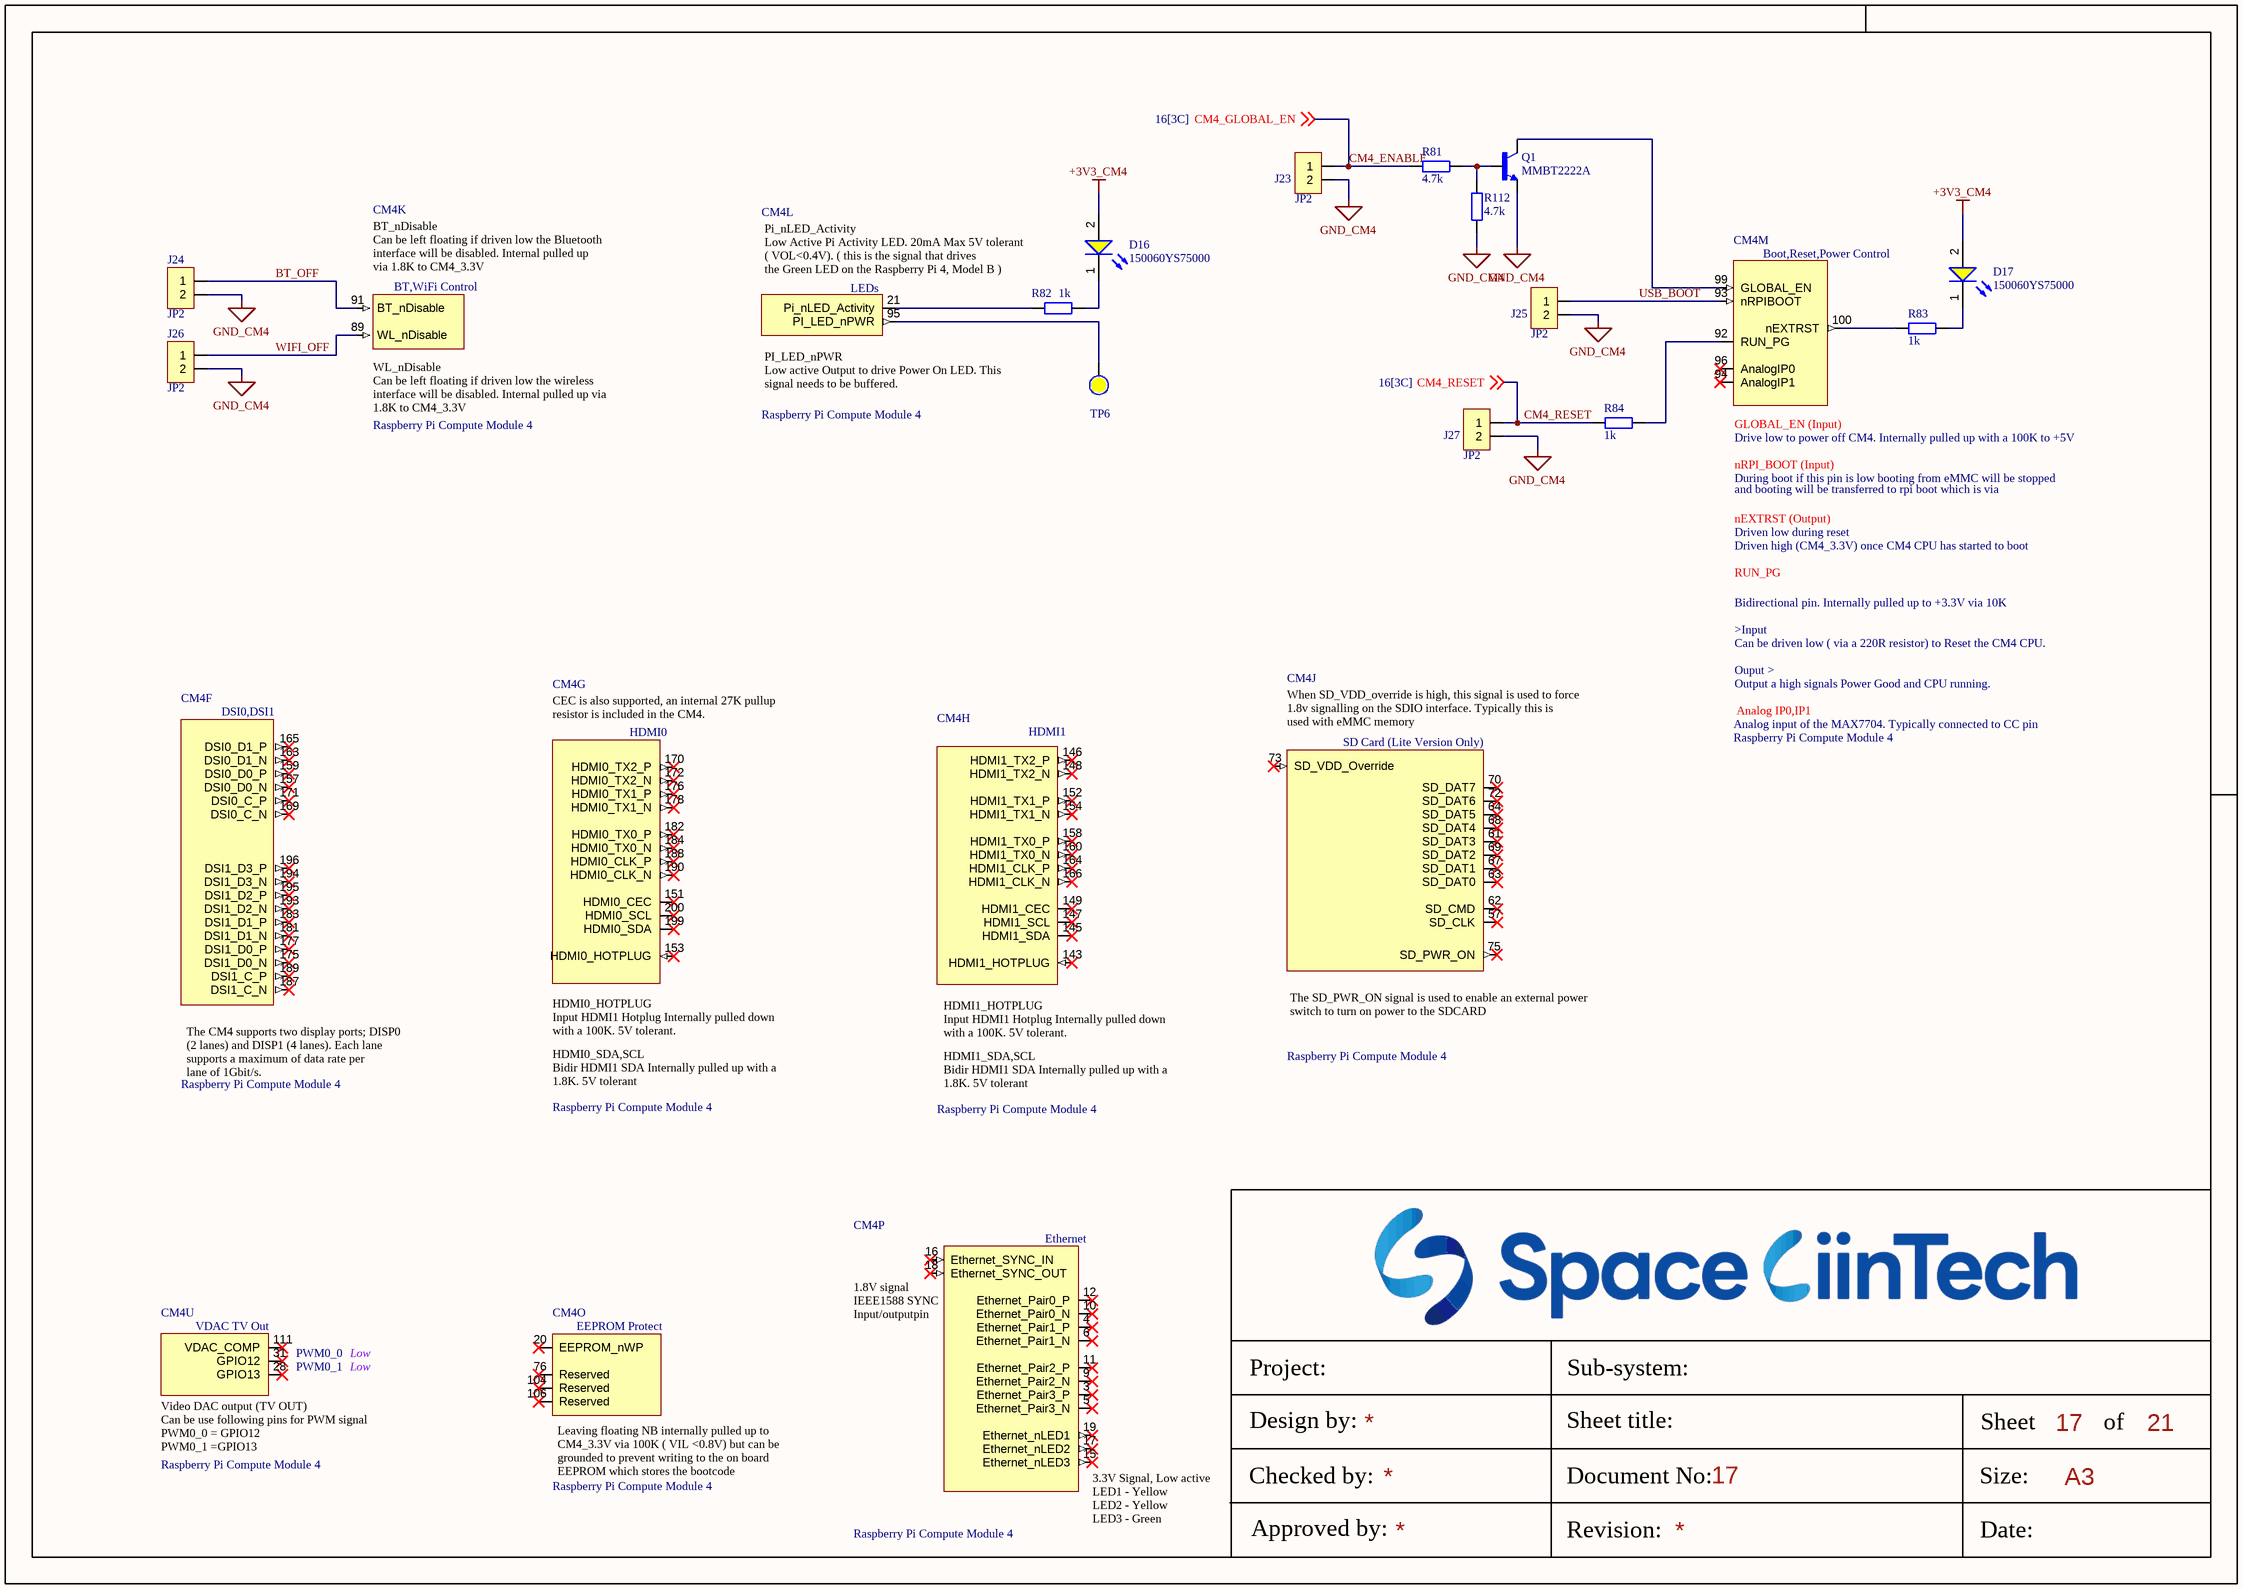
[diagram p18: obc-v2_CM4-FUNCTION.SchDoc]

### Parts
CM4  Raspberry Pi Compute Module 4  [CM4-DF40HC(3.0)-100DS-0.4v_3mm_1.5mm]  (parts F,G,H,J,K,L,M,O,P,U of 21)  (no BOM)
D16  150060YS75000  [WL-SMCW_0603_150060xx75000]
D17  150060YS75000  [WL-SMCW_0603_150060xx75000]
J23  JP2  [JP2-D1T]
J24  JP2  [JP2-D1T]
J25  JP2  [JP2-D1T]
J26  JP2  [JP2-D1T]
J27  JP2  [JP2-D1T]
Q1  MMBT2222A  [SOT95P240X120-3N]
R81  4.7k  [RES_C_1608X60]
R82  1k  [RES_C_1608X60]
R83  1k  [RES_C_1608X60]
R84  1k  [RES_C_1608X60]
R112  4.7k  [RES_C_1608X60]
TP6  (no value)  [Test Point 1 Side]  (no BOM)

### Nets
+3V3_CM4: D16.2(A) D17.2(A)
GND_CM4: J23.2 J24.2 J25.2 J26.2 J27.2 Q1.2(E) R112.2
BT_OFF: CM4.91(BT_nDisable) J24.1
CM4_ENABLE: J23.1 R81.2 ; off-sheet CM4_GLOBAL_EN  [also labelled CM4_GLOBAL_EN]
CM4_RESET: J27.1 R84.2 ; off-sheet CM4_RESET
USB_BOOT: CM4.93(nRPIBOOT) J25.1
WIFI_OFF: CM4.89(WL_nDisable) J26.1
NetCM4_21: CM4.21(Pi_nLED_Activity) R82.2
NetCM4_92: CM4.92(RUN_PG) R84.1
NetCM4_95: CM4.95(PI_LED_nPWR) TP6.0
NetCM4_99: CM4.99(GLOBAL_EN) Q1.3(C)
NetCM4_100: CM4.100(nEXTRST) R83.2
NetD16_1: D16.1(K) R82.1
NetD17_1: D17.1(K) R83.1
NetQ1_1: Q1.1(B) R81.1 R112.1

Not connected (* = marked no-connect by the designer): CM4 3(Ethernet_Pair3_P)* 4(Ethernet_Pair1_P)* 5(Ethernet_Pair3_N)* 6(Ethernet_Pair1_N)* 9(Ethernet_Pair2_N)* 10(Ethernet_Pair0_N)* 11(Ethernet_Pair2_P)* 12(Ethernet_Pair0_P)* 15(Ethernet_nLED3)* 16(Ethernet_SYNC_IN)* 17(Ethernet_nLED2)* 18(Ethernet_SYNC_OUT)* 19(Ethernet_nLED1)* 20(EEPROM_nWP)* 28(GPIO13)* 31(GPIO12)* 57(SD_CLK)* 61(SD_DAT3)* 62(SD_CMD)* 63(SD_DAT0)* 64(SD_DAT5)* 67(SD_DAT1)* 68(SD_DAT4)* 69(SD_DAT2)* 70(SD_DAT7)* 72(SD_DAT6)* 73(SD_VDD_Override)* 75(SD_PWR_ON)* 76(Reserved)* 94(AnalogIP1)* 96(AnalogIP0)* 104(Reserved)* 106(Reserved)* 111(VDAC_COMP)* 143(HDMI1_HOTPLUG)* 145(HDMI1_SDA)* 146(HDMI1_TX2_P)* 147(HDMI1_SCL)* 148(HDMI1_TX2_N)* 149(HDMI1_CEC)* 151(HDMI0_CEC)* 152(HDMI1_TX1_P)* 153(HDMI0_HOTPLUG)* 154(HDMI1_TX1_N)* 157(DSI0_D0_N)* 158(HDMI1_TX0_P)* 159(DSI0_D0_P)* 160(HDMI1_TX0_N)* 163(DSI0_D1_N)* 164(HDMI1_CLK_P)* 165(DSI0_D1_P)* 166(HDMI1_CLK_N)* 169(DSI0_C_N)* 170(HDMI0_TX2_P)* 171(DSI0_C_P)* 172(HDMI0_TX2_N)* 175(DSI1_D0_N)* 176(HDMI0_TX1_P)* 177(DSI1_D0_P)* 178(HDMI0_TX1_N)* 181(DSI1_D1_N)* 182(HDMI0_TX0_P)* 183(DSI1_D1_P)* 184(HDMI0_TX0_N)* 187(DSI1_C_N)* 188(HDMI0_CLK_P)* 189(DSI1_C_P)* 190(HDMI0_CLK_N)* 193(DSI1_D2_N)* 194(DSI1_D3_N)* 195(DSI1_D2_P)* 196(DSI1_D3_P)* 199(HDMI0_SDA)* 200(HDMI0_SCL)*

### Notes on the sheet
- Project:
- Sub-system:
- Design by:
- Sheet title:
- Sheet
- A3
- of
- Checked by:
- Approved by:
- Revision:
- Document No:
- Size:
- Date:
- (in symbol CM4, part F) DSI0,DSI1; The CM4 supports two display ports; DISP0 (2 lanes) and DISP1 (4 lanes). Each lane supports a maximum of data rate per / lane of 1Gbit/s.
- (in symbol CM4, part G) HDMI0; CEC is also supported, an internal 27K pullup resistor is included in the CM4.; HDMI0_HOTPLUG / Input HDMI1 Hotplug Internally pulled down with a 100K. 5V tolerant.; HDMI0_SDA,SCL / Bidir HDMI1 SDA Internally pulled up with a 1.8K. 5V tolerant
- (in symbol CM4, part H) HDMI1; HDMI1_HOTPLUG / Input HDMI1 Hotplug Internally pulled down with a 100K. 5V tolerant.; HDMI1_SDA,SCL / Bidir HDMI1 SDA Internally pulled up with a 1.8K. 5V tolerant
- (in symbol CM4, part J) When SD_VDD_override is high, this signal is used to force 1.8v signalling on the SDIO interface. Typically this is / used with eMMC memory; SD Card (Lite Version Only); by Amornthep Phunsin; The SD_PWR_ON signal is used to enable an external power switch to turn on power to the SDCARD
- (in symbol CM4, part K) BT_nDisable / Can be left floating if driven low the Bluetooth interface will be disabled. Internal pulled up / via 1.8K to CM4_3.3V; BT,WiFi Control; WL_nDisable / Can be left floating if driven low the wireless interface will be disabled. Internal pulled up via / 1.8K to CM4_3.3V
- (in symbol CM4, part L) Pi_nLED_Activity / Low Active Pi Activity LED. 20mA Max 5V tolerant ( VOL<0.4V). ( this is the signal that drives / the Green LED on the Raspberry Pi 4, Model B ); LEDs; PI_LED_nPWR / Low active Output to drive Power On LED. This signal needs to be buffered.
- (in symbol CM4, part M) Boot,Reset,Power Control; GLOBAL_EN (Input); Drive low to power off CM4. Internally pulled up with a 100K to +5V; nRPI_BOOT (Input); During boot if this pin is low booting from eMMC will be stopped; and booting will be transferred to rpi boot which is via; nEXTRST (Output); Driven low during reset; Driven high (CM4_3.3V) once CM4 CPU has started to boot; Bidirectional pin. Internally pulled up to +3.3V via 10K / >Input / Can be driven low ( via a 220R resistor) to Reset the CM4 CPU. / Ouput > / Output a high signals Power Good and CPU running.; Analog IP0,IP1; Analog input of the MAX7704. Typically connected to CC pin
- (in symbol CM4, part O) EEPROM Protect; Leaving floating NB internally pulled up to CM4_3.3V via 100K ( VIL <0.8V) but can be / grounded to prevent writing to the on board EEPROM which stores the bootcode
- (in symbol CM4, part P) Ethernet; 1.8V signal / IEEE1588 SYNC Input/outputpin; by Amornthep Phunsin; 3.3V Signal, Low active / LED1 - Yellow / LED2 - Yellow / LED3 - Green
- (in symbol CM4, part U) VDAC TV Out; PWM0_0; Low; PWM0_1; Video DAC output (TV OUT) / Can be use following pins for PWM signal / PWM0_0 = GPIO12 / PWM0_1 =GPIO13

### Library data of the parts
CM4 = CM4: Raspberry Pi Compute Module 4 by Amornthep Phunsin
D16 D17 = CMP-1426-00005-2: LED YELLOW CLEAR 0603 SMD; NexarPartId: 29687085; Wavelength: 590nm; Luminous Intensity: 120mcd; Peak Wavelength: 595nm; Forward Current: 100mA; Power Dissipation: 72mW; Forward Voltage: 2V; Test Current: 20mA; Reverse Voltage: 5V; Lens Style: Clear, Rectangular; Max Junction Temperature (Tj): 95°C; Viewing Angle: 140°; Case Code (Imperial): 0603; Height: 700µm; REACH SVHC: Unknown; Dominant Wavelength: 590nm; Min Operating Temperature: -40°C; Color: Yellow; Width: 800µm; Mount: Surface Mount; Packaging: Tape and Reel; Max Operating Temperature: 85°C; RoHS: Compliant; Max Reverse Voltage (DC): 5V; Case Code (Metric): 1608; Length: 1.6mm; Case/Package: 0603
J23-J27 = JP2: WR-PHD 2.54 mm Angled Socket Header; Manufacturer: W¨¹rth Elektronik eiSos GmbH; partNo: 613002143121; ComponentLink1 Description: Manufacturer; ComponentLink2 Description: Datasheet; NoPins: 02; Created Date: 29 March 2013; ComponentLink1URL: http://www.we-online.com; ComponentLink2URL: http://katalog.we-online.de/em/datasheet/6130xx143121.pdf; Created by: Karrer Zheng
Q1 = MMBT2222A: BJT, SOT-23, 40V, 600mA, NPN, 0.25W, 150°C; MF: Diotec Semiconductor; SnapEDA_Link: https://www.snapeda.com/parts/MMBT2222A/Diotec/view-part/?ref=snap; Package: SOT-23 Diotec; Value: *; MP: MMBT2222A; Check_prices: https://www.snapeda.com/parts/MMBT2222A/Diotec/view-part/?ref=eda
R81-R84 R112 = Tro 0603 1% 10k: as R71-R80 on sheet obc-v2_CM4-IRQ-CTRL; Kieu_Chan: *
TP6 = Test Point: Solder: NF

## Sheet obc-v2_CM4-CSI.SchDoc
size 420 x 297 mm; SheetNumber: 18; SheetTotal: 21
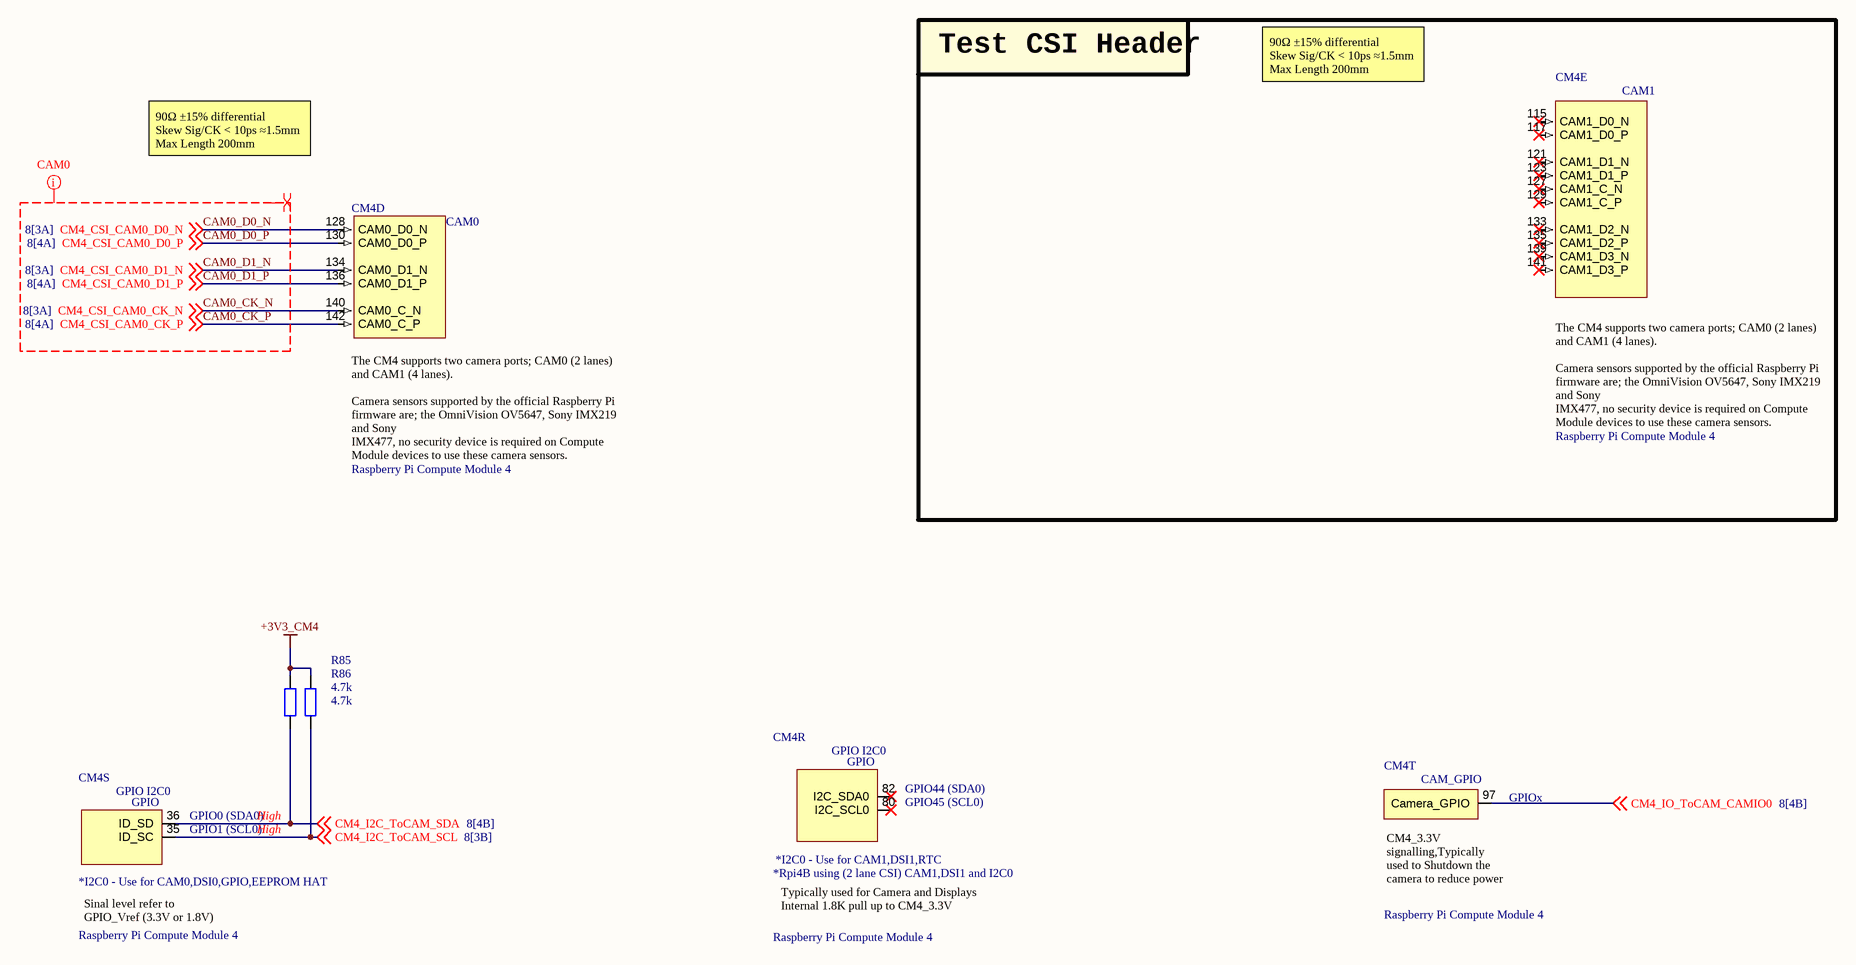
[diagram p19: obc-v2_CM4-CSI.SchDoc]

### Parts
CM4  Raspberry Pi Compute Module 4  [CM4-DF40HC(3.0)-100DS-0.4v_3mm_1.5mm]  (parts D,E,R,S,T of 21)  (no BOM)
R85  4.7k  [RES_C_1608X60]
R86  4.7k  [RES_C_1608X60]

### Blocks framed on the sheet
Test CSI Header: CM4

### Nets
+3V3_CM4: R85.1 R86.1
CAM0_CK_N: CM4.140(CAM0_C_N) ; off-sheet CM4_CSI_CAM0_CK_N  [also labelled CM4_CSI_CAM0_CK_N]
CAM0_CK_P: CM4.142(CAM0_C_P) ; off-sheet CM4_CSI_CAM0_CK_P  [also labelled CM4_CSI_CAM0_CK_P]
CAM0_D0_N: CM4.128(CAM0_D0_N) ; off-sheet CM4_CSI_CAM0_D0_N  [also labelled CM4_CSI_CAM0_D0_N]
CAM0_D0_P: CM4.130(CAM0_D0_P) ; off-sheet CM4_CSI_CAM0_D0_P  [also labelled CM4_CSI_CAM0_D0_P]
CAM0_D1_N: CM4.134(CAM0_D1_N) ; off-sheet CM4_CSI_CAM0_D1_N  [also labelled CM4_CSI_CAM0_D1_N]
CAM0_D1_P: CM4.136(CAM0_D1_P) ; off-sheet CM4_CSI_CAM0_D1_P  [also labelled CM4_CSI_CAM0_D1_P]
CM4_I2C_ToCAM_SCL: CM4.35(ID_SC) R86.2 ; off-sheet CM4_I2C_ToCAM_SCL
CM4_I2C_ToCAM_SDA: CM4.36(ID_SD) R85.2 ; off-sheet CM4_I2C_ToCAM_SDA
CM4_IO_ToCAM_CAMIO0: CM4.97(Camera_GPIO) ; off-sheet CM4_IO_ToCAM_CAMIO0

Not connected (* = marked no-connect by the designer): CM4 80(I2C_SCL0)* 82(I2C_SDA0)* 115(CAM1_D0_N)* 117(CAM1_D0_P)* 121(CAM1_D1_N)* 123(CAM1_D1_P)* 127(CAM1_C_N)* 129(CAM1_C_P)* 133(CAM1_D2_N)* 135(CAM1_D2_P)* 139(CAM1_D3_N)* 141(CAM1_D3_P)*

### Layout directives
differential pair; differential pair class DIFF100: CAM0_CK_N, CAM0_CK_P, CAM0_D0_N, CAM0_D0_P, CAM0_D1_N, CAM0_D1_P, CM4_CSI_CAM0_CK_N, CM4_CSI_CAM0_CK_P, CM4_CSI_CAM0_D0_N, CM4_CSI_CAM0_D0_P, CM4_CSI_CAM0_D1_N, CM4_CSI_CAM0_D1_P
net class CAM0: CAM0_CK_N, CAM0_CK_P, CAM0_D0_N, CAM0_D0_P, CAM0_D1_N, CAM0_D1_P, CM4_CSI_CAM0_CK_N, CM4_CSI_CAM0_CK_P, CM4_CSI_CAM0_D0_N, CM4_CSI_CAM0_D0_P, CM4_CSI_CAM0_D1_N, CM4_CSI_CAM0_D1_P

### Notes on the sheet
- 90Ω ±15% differential
  Skew Sig/CK < 10ps ≈1.5mm
  Max Length 200mm
- Project:
- Sub-system:
- Design by:
- Sheet title:
- Sheet
- A3
- of
- Checked by:
- Approved by:
- Revision:
- Document No:
- Size:
- Date:
- (in symbol CM4, part D) CAM0; The CM4 supports two camera ports; CAM0 (2 lanes) and CAM1 (4 lanes). / Camera sensors supported by the official Raspberry Pi firmware are; the OmniVision OV5647, Sony IMX219 and Sony / IMX477, no security device is required on Compute Module devices to use these camera sensors.
- (in symbol CM4, part E) CAM1; The CM4 supports two camera ports; CAM0 (2 lanes) and CAM1 (4 lanes). / Camera sensors supported by the official Raspberry Pi firmware are; the OmniVision OV5647, Sony IMX219 and Sony / IMX477, no security device is required on Compute Module devices to use these camera sensors.
- (in symbol CM4, part R) GPIO I2C0; GPIO; GPIO44 (SDA0); GPIO45 (SCL0); *I2C0 - Use for CAM1,DSI1,RTC; *Rpi4B using (2 lane CSI) CAM1,DSI1 and I2C0; Typically used for Camera and Displays Internal 1.8K pull up to CM4_3.3V
- (in symbol CM4, part S) GPIO I2C0; GPIO; GPIO0 (SDA0); High; GPIO1 (SCL0); *I2C0 - Use for CAM0,DSI0,GPIO,EEPROM HAT; Sinal level refer to  GPIO_Vref (3.3V or 1.8V)
- (in symbol CM4, part T) CAM_GPIO; GPIOx; CM4_3.3V signalling,Typically used to Shutdown the camera to reduce power

### Library data of the parts
CM4 = CM4: as CM4 on sheet obc-v2_CM4-FUNCTION
R85 R86 = Tro 0603 1% 10k: as R71-R80 on sheet obc-v2_CM4-IRQ-CTRL; Kieu_Chan: *

## Sheet obc-v2_CM4-POWER.SchDoc
size 420 x 297 mm; SheetNumber: 21; SheetTotal: 23
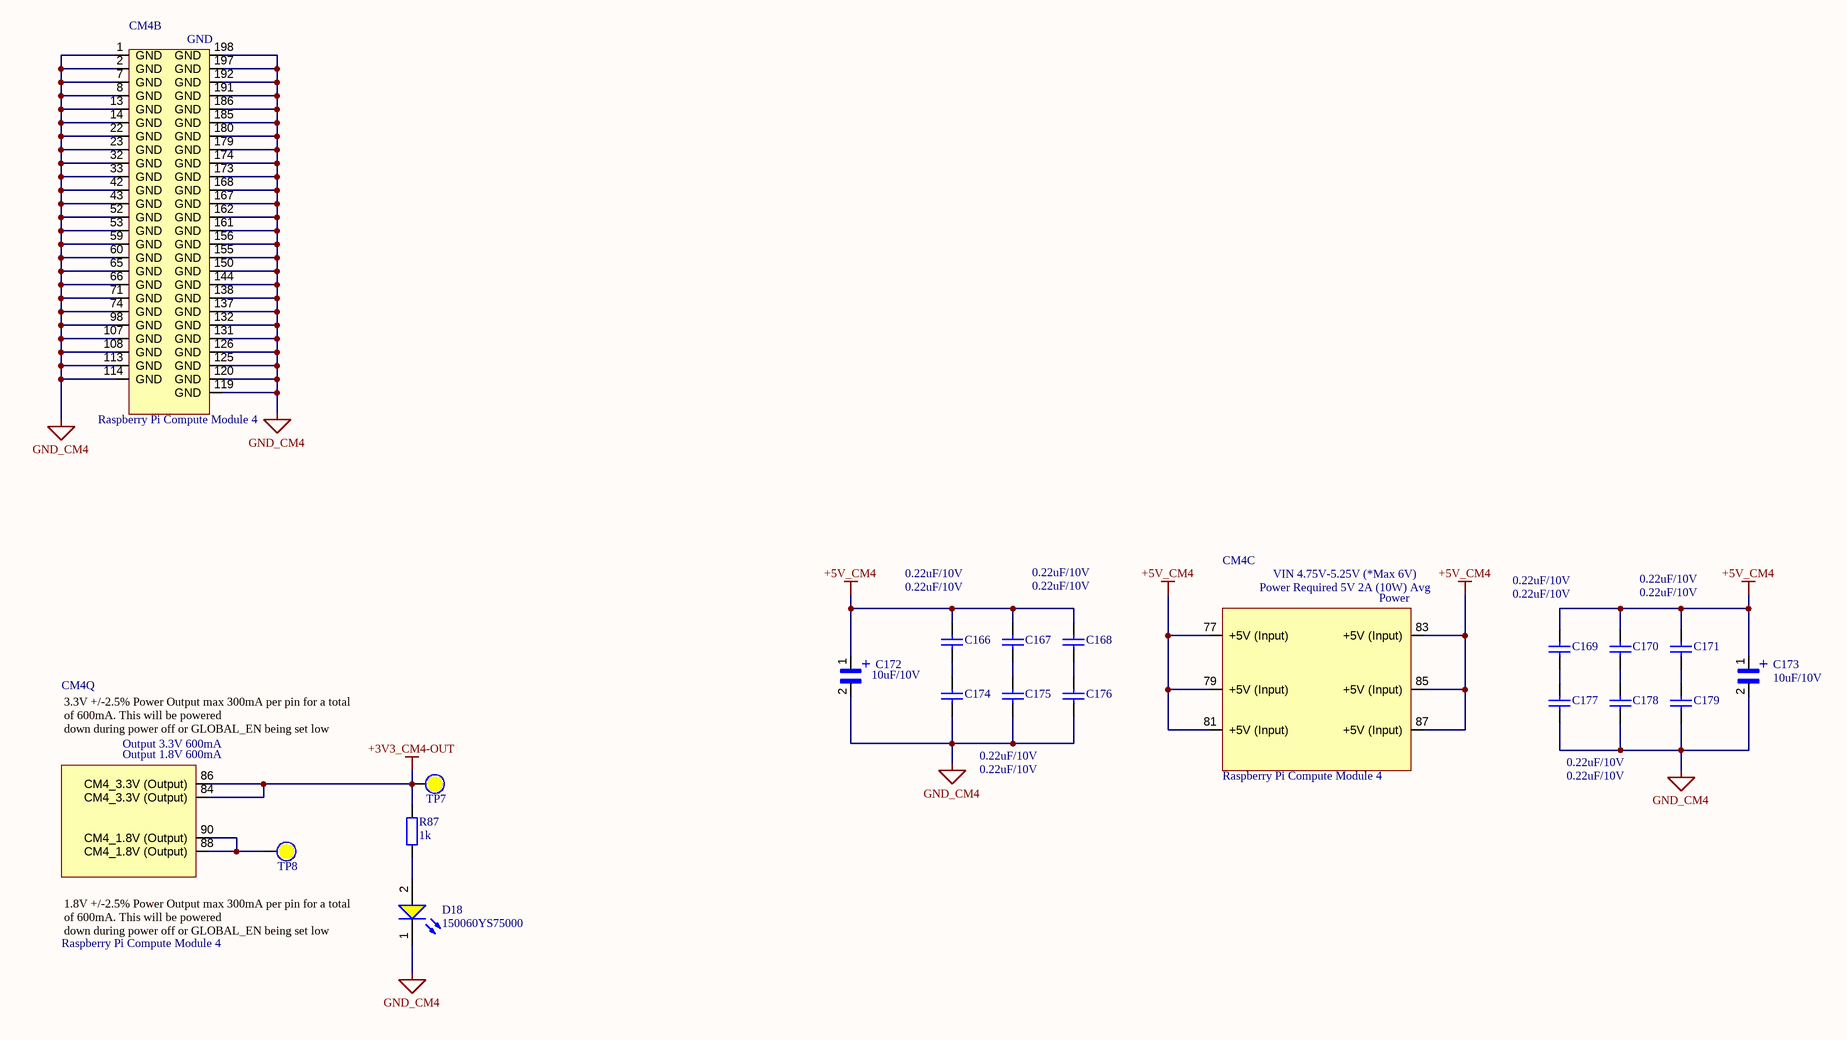
[diagram p20: obc-v2_CM4-POWER.SchDoc]

### Parts
C166  0.22uF/10V  [CAP_C_1005X60]
C167  0.22uF/10V  [CAP_C_1005X60]
C168  0.22uF/10V  [CAP_C_1005X60]
C169  0.22uF/10V  [CAP_C_1005X60]
C170  0.22uF/10V  [CAP_C_1005X60]
C171  0.22uF/10V  [CAP_C_1005X60]
C172  10uF/10V  [CAP_MP_2012X170]
C173  10uF/10V  [CAP_MP_2012X170]
C174  0.22uF/10V  [CAP_C_1005X60]
C175  0.22uF/10V  [CAP_C_1005X60]
C176  0.22uF/10V  [CAP_C_1005X60]
C177  0.22uF/10V  [CAP_C_1005X60]
C178  0.22uF/10V  [CAP_C_1005X60]
C179  0.22uF/10V  [CAP_C_1005X60]
CM4  Raspberry Pi Compute Module 4  [CM4-DF40HC(3.0)-100DS-0.4v_3mm_1.5mm]  (parts B,C,Q of 21)  (no BOM)
D18  150060YS75000  [WL-SMCW_0603_150060xx75000]
R87  1k  [RES_C_1608X60]
TP7  (no value)  [Test Point 1 Side]  (no BOM)
TP8  (no value)  [Test Point 1 Side]  (no BOM)

### Nets
+3V3_CM4-OUT: CM4.84(CM4_3.3V_(Output)) CM4.86(CM4_3.3V_(Output)) R87.2 TP7.0
+5V_CM4: C166.1 C167.1 C168.1 C169.1 C170.1 C171.1 C172.1 C173.1 CM4.77(+5V_(Input)) CM4.79(+5V_(Input)) CM4.81(+5V_(Input)) CM4.83(+5V_(Input)) CM4.85(+5V_(Input)) CM4.87(+5V_(Input))  [project net +5V_AUX-Adaptor]
GND_CM4: C172.2 C173.2 C174.2 C175.2 C176.2 C177.2 C178.2 C179.2 CM4.1(GND) CM4.2(GND) CM4.7(GND) CM4.8(GND) CM4.13(GND) CM4.14(GND) CM4.22(GND) CM4.23(GND) CM4.32(GND) CM4.33(GND) CM4.42(GND) CM4.43(GND) CM4.52(GND) CM4.53(GND) CM4.59(GND) CM4.60(GND) CM4.65(GND) CM4.66(GND) CM4.71(GND) CM4.74(GND) CM4.98(GND) CM4.107(GND) CM4.108(GND) CM4.113(GND) CM4.114(GND) CM4.119(GND) CM4.120(GND) CM4.125(GND) CM4.126(GND) CM4.131(GND) CM4.132(GND) CM4.137(GND) CM4.138(GND) CM4.144(GND) CM4.150(GND) CM4.155(GND) CM4.156(GND) CM4.161(GND) CM4.162(GND) CM4.167(GND) CM4.168(GND) CM4.173(GND) CM4.174(GND) CM4.179(GND) CM4.180(GND) CM4.185(GND) CM4.186(GND) CM4.191(GND) CM4.192(GND) CM4.197(GND) CM4.198(GND) D18.1(K)
NetC166_2: C166.2 C174.1
NetC167_2: C167.2 C175.1
NetC168_2: C168.2 C176.1
NetC169_2: C169.2 C177.1
NetC170_2: C170.2 C178.1
NetC171_2: C171.2 C179.1
NetCM4_88: CM4.88(CM4_1.8V_(Output)) CM4.90(CM4_1.8V_(Output)) TP8.0
NetD18_2: D18.2(A) R87.1

### Notes on the sheet
- Project:
- Sub-system:
- Design by:
- Sheet title:
- Sheet
- A3
- of
- Checked by:
- Approved by:
- Revision:
- Document No:
- Size:
- Date:
- (in symbol CM4, part C) VIN 4.75V-5.25V (*Max 6V); Power Required 5V 2A (10W) Avg; Power; by Amornthep Phunsin
- (in symbol CM4, part Q) 3.3V +/-2.5% Power Output max 300mA per pin for a total of 600mA. This will be powered / down during power off or GLOBAL_EN being set low; Output 3.3V 600mA; Output 1.8V 600mA; 1.8V +/-2.5% Power Output max 300mA per pin for a total of 600mA. This will be powered / down during power off or GLOBAL_EN being set low
- (in symbol TACR686M003RTA) +

### Library data of the parts
C166-C171 C174-C179 = Tu 0402 33nF 10V: as C148-C159 on sheet obc-v2_CM4-IRQ-CTRL; Kieu_Chan: *
C172 C173 = TACR686M003RTA: CAPP; MF: AVX; Availability: Unavailable; SnapEDA_Link: https://www.snapeda.com/parts/TACR686M003RTA/AVX/view-part/1745975/?ref=snap; MP: TACR686M003RTA; Value: *; Price: None; Package: 0805 AVX
CM4 = CM4: as CM4 on sheet obc-v2_CM4-FUNCTION
D18 = CMP-1426-00005-2: as D16 on sheet obc-v2_CM4-FUNCTION; Case Code (Imperial): 0603; Height: 700µm; REACH SVHC: Unknown; Dominant Wavelength: 590nm; Min Operating Temperature: -40°C; Color: Yellow; Width: 800µm; Mount: Surface Mount; Packaging: Tape and Reel; Max Operating Temperature: 85°C; RoHS: Compliant; Max Reverse Voltage (DC): 5V; Case Code (Metric): 1608; Length: 1.6mm; Case/Package: 0603
R87 = Tro 0603 1% 10k: as R71-R80 on sheet obc-v2_CM4-IRQ-CTRL; Kieu_Chan: *
TP7 TP8 = Test Point: Solder: NF

## Sheet obc-v2_MCU-POWER.SchDoc
size 420 x 297 mm; SheetNumber: 22; SheetTotal: 23
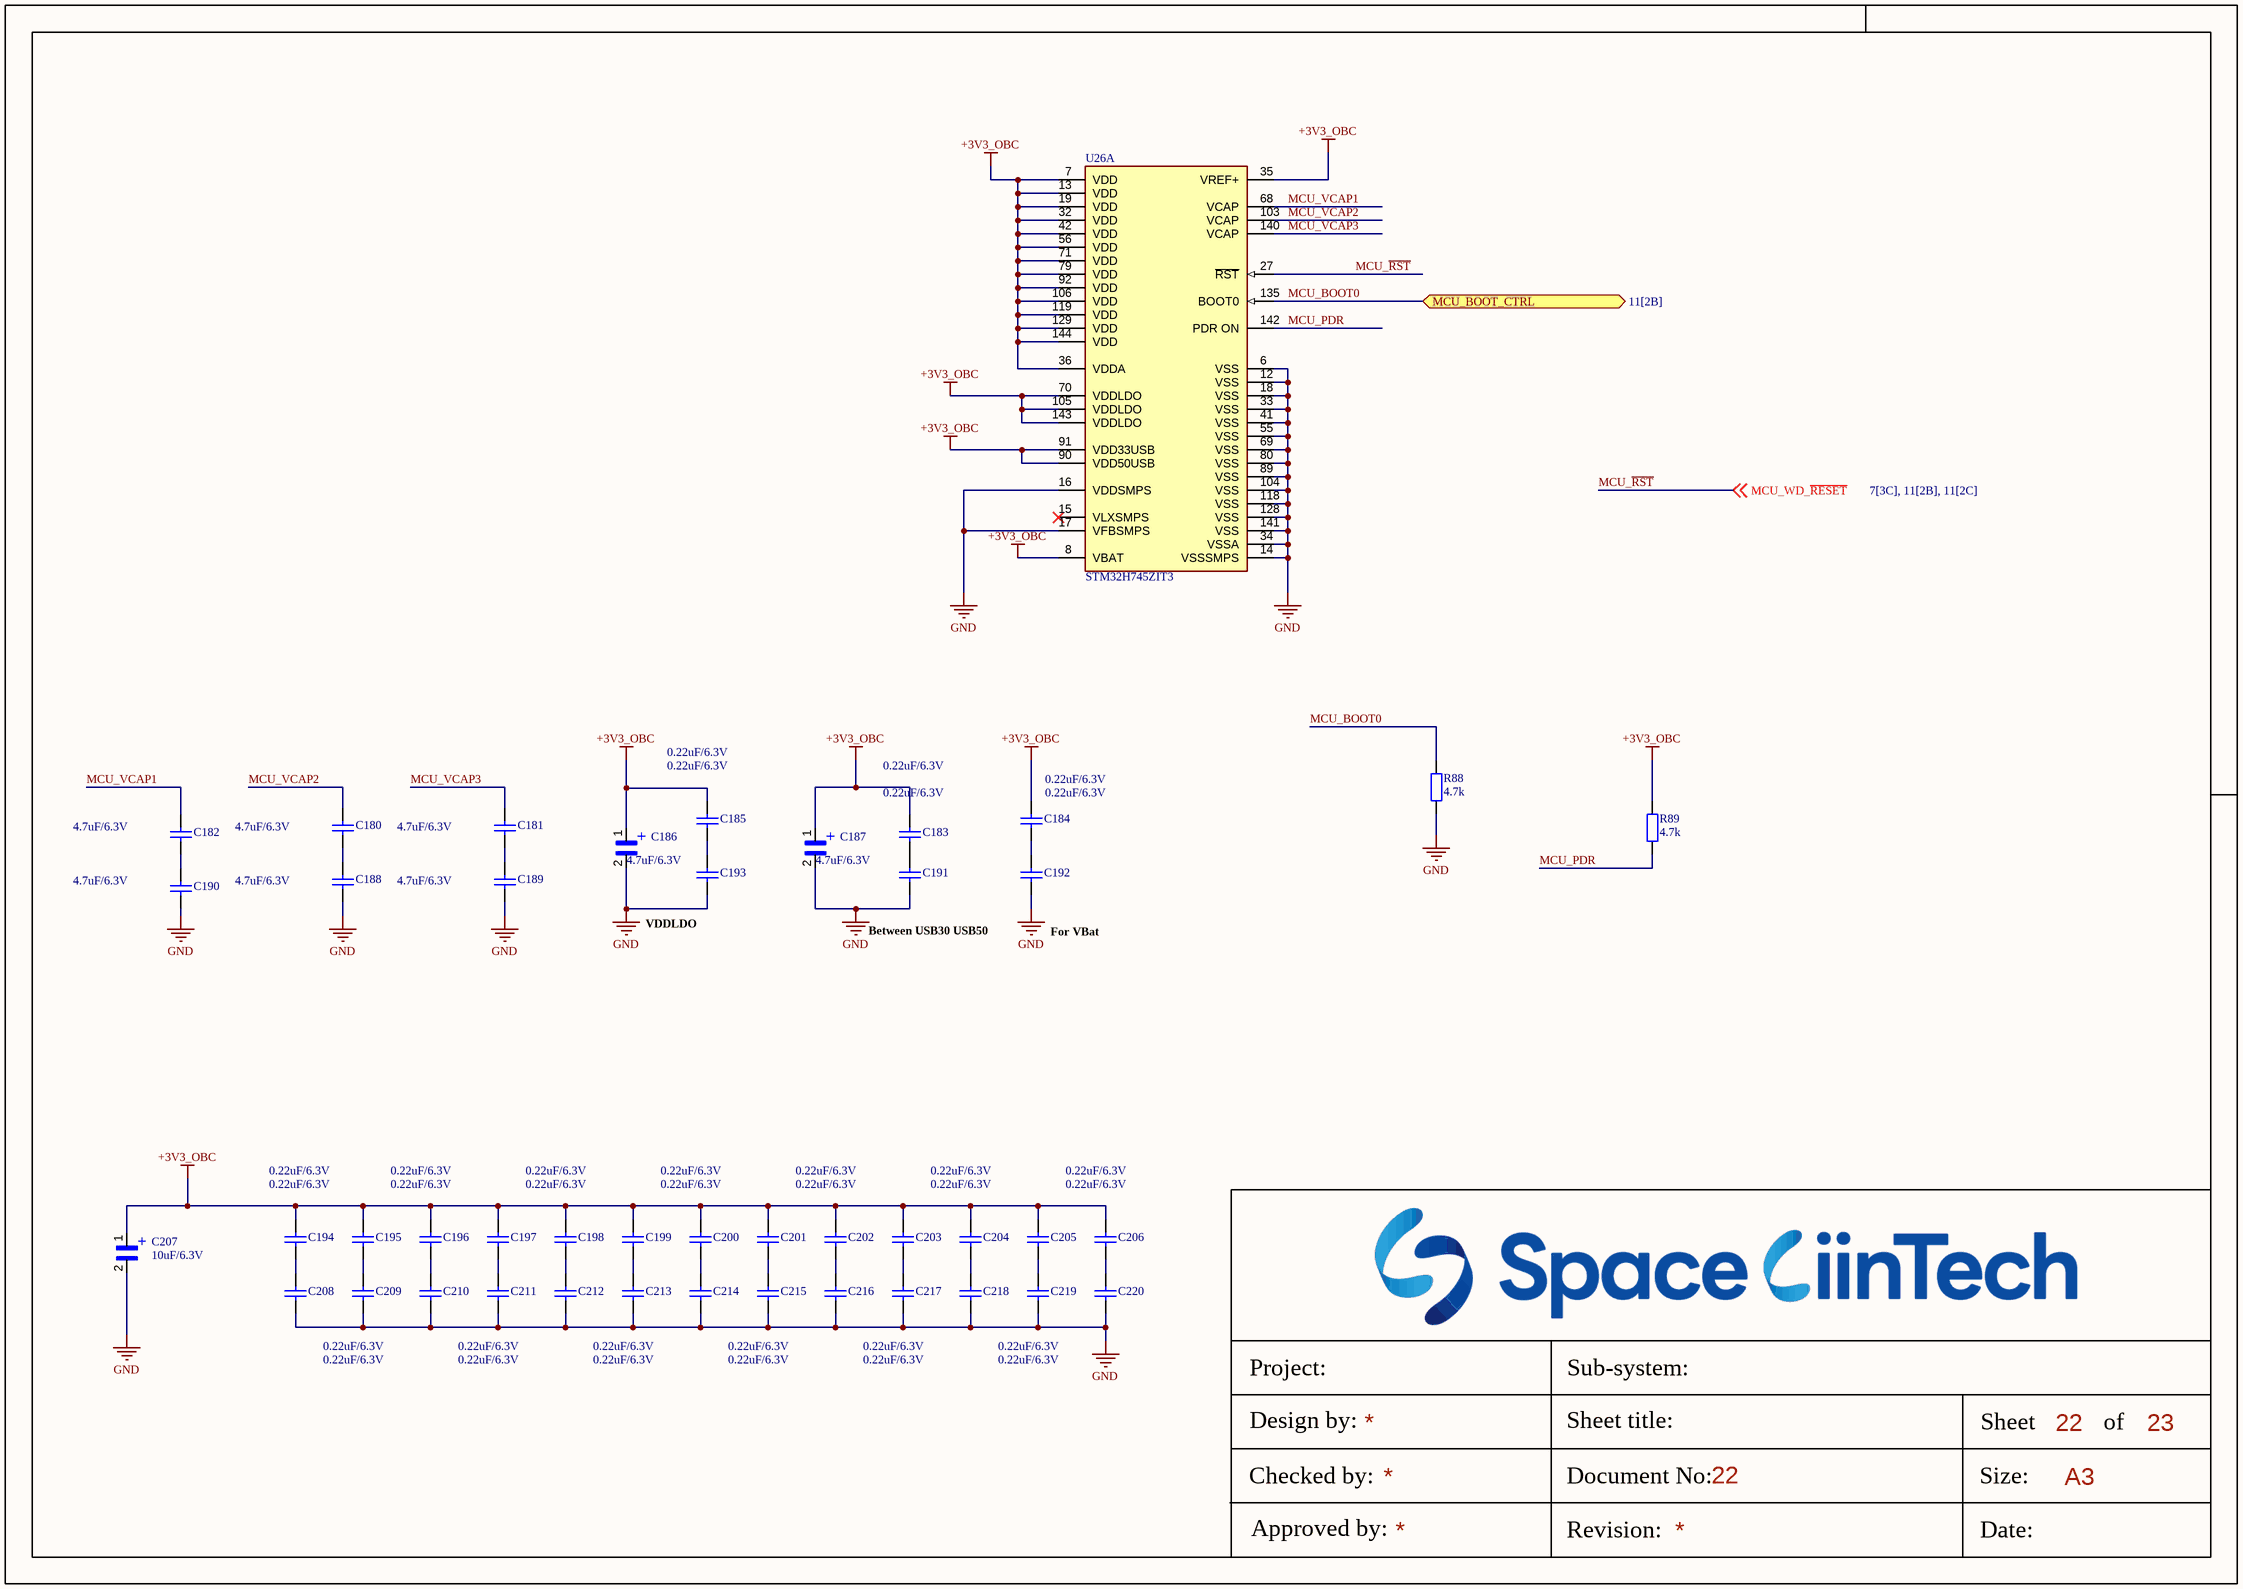
[diagram p21: obc-v2_MCU-POWER.SchDoc]

### Parts
C180  4.7uF/6.3V  [CAP_C_1005X60]
C181  4.7uF/6.3V  [CAP_C_1005X60]
C182  4.7uF/6.3V  [CAP_C_1005X60]
C183  0.22uF/6.3V  [CAP_C_1005X60]
C184  0.22uF/6.3V  [CAP_C_1005X60]
C185  0.22uF/6.3V  [CAP_C_1005X60]
C186  4.7uF/6.3V  [CAP_MP_1608X90]
C187  4.7uF/6.3V  [CAP_MP_1608X90]
C188  4.7uF/6.3V  [CAP_C_1005X60]
C189  4.7uF/6.3V  [CAP_C_1005X60]
C190  4.7uF/6.3V  [CAP_C_1005X60]
C191  0.22uF/6.3V  [CAP_C_1005X60]
C192  0.22uF/6.3V  [CAP_C_1005X60]
C193  0.22uF/6.3V  [CAP_C_1005X60]
C194  0.22uF/6.3V  [CAP_C_1005X60]
C195  0.22uF/6.3V  [CAP_C_1005X60]
C196  0.22uF/6.3V  [CAP_C_1005X60]
C197  0.22uF/6.3V  [CAP_C_1005X60]
C198  0.22uF/6.3V  [CAP_C_1005X60]
C199  0.22uF/6.3V  [CAP_C_1005X60]
C200  0.22uF/6.3V  [CAP_C_1005X60]
C201  0.22uF/6.3V  [CAP_C_1005X60]
C202  0.22uF/6.3V  [CAP_C_1005X60]
C203  0.22uF/6.3V  [CAP_C_1005X60]
C204  0.22uF/6.3V  [CAP_C_1005X60]
C205  0.22uF/6.3V  [CAP_C_1005X60]
C206  0.22uF/6.3V  [CAP_C_1005X60]
C207  10uF/6.3V  [CAP_MP_2012X170]
C208  0.22uF/6.3V  [CAP_C_1005X60]
C209  0.22uF/6.3V  [CAP_C_1005X60]
C210  0.22uF/6.3V  [CAP_C_1005X60]
C211  0.22uF/6.3V  [CAP_C_1005X60]
C212  0.22uF/6.3V  [CAP_C_1005X60]
C213  0.22uF/6.3V  [CAP_C_1005X60]
C214  0.22uF/6.3V  [CAP_C_1005X60]
C215  0.22uF/6.3V  [CAP_C_1005X60]
C216  0.22uF/6.3V  [CAP_C_1005X60]
C217  0.22uF/6.3V  [CAP_C_1005X60]
C218  0.22uF/6.3V  [CAP_C_1005X60]
C219  0.22uF/6.3V  [CAP_C_1005X60]
C220  0.22uF/6.3V  [CAP_C_1005X60]
R88  4.7k  [RES_C_1608X60]
R89  4.7k  [RES_C_1608X60]
U26  STM32H745ZIT3  [FP-LQFP144-1A-MFG]  (part A of 3)

### Ports
MCU_BOOT_CTRL (bidir, see 11[2B])

### Nets
+3V3_OBC: C183.1 C184.1 C185.1 C186.1 C187.1 C194.1 C195.1 C196.1 C197.1 C198.1 C199.1 C200.1 C201.1 C202.1 C203.1 C204.1 C205.1 C206.1 C207.1 R89.1 U26.7(VDD) U26.8(VBAT) U26.13(VDD) U26.19(VDD) U26.32(VDD) U26.35(VREF+) U26.36(VDDA) U26.42(VDD) U26.56(VDD) U26.70(VDDLDO) U26.71(VDD) U26.79(VDD) U26.90(VDD50USB) U26.91(VDD33USB) U26.92(VDD) U26.105(VDDLDO) U26.106(VDD) U26.119(VDD) U26.129(VDD) U26.143(VDDLDO) U26.144(VDD)
GND: C186.2 C187.2 C188.2 C189.2 C190.2 C191.2 C192.2 C193.2 C207.2 C208.2 C209.2 C210.2 C211.2 C212.2 C213.2 C214.2 C215.2 C216.2 C217.2 C218.2 C219.2 C220.2 R88.1 U26.6(VSS) U26.12(VSS) U26.14(VSSSMPS) U26.16(VDDSMPS) U26.17(VFBSMPS) U26.18(VSS) U26.33(VSS) U26.34(VSSA) U26.41(VSS) U26.55(VSS) U26.69(VSS) U26.80(VSS) U26.89(VSS) U26.104(VSS) U26.118(VSS) U26.128(VSS) U26.141(VSS)
MCU_BOOT0: R88.2 U26.135(BOOT0) ; port MCU_BOOT_CTRL
MCU_PDR: R89.2 U26.142(PDR_ON)
MCU_~{RST}: U26.27(~{RST}) ; off-sheet MCU_WD_~{RESET}  [also labelled MCU_WD_~{RESET}]
MCU_VCAP1: C182.1 U26.68(VCAP)
MCU_VCAP2: C180.1 U26.103(VCAP)
MCU_VCAP3: C181.1 U26.140(VCAP)
NetC180_2: C180.2 C188.1
NetC181_2: C181.2 C189.1
NetC182_2: C182.2 C190.1
NetC183_2: C183.2 C191.1
NetC184_2: C184.2 C192.1
NetC185_2: C185.2 C193.1
NetC194_2: C194.2 C208.1
NetC195_2: C195.2 C209.1
NetC196_2: C196.2 C210.1
NetC197_2: C197.2 C211.1
NetC198_2: C198.2 C212.1
NetC199_2: C199.2 C213.1
NetC200_2: C200.2 C214.1
NetC201_2: C201.2 C215.1
NetC202_2: C202.2 C216.1
NetC203_2: C203.2 C217.1
NetC204_2: C204.2 C218.1
NetC205_2: C205.2 C219.1
NetC206_2: C206.2 C220.1

Not connected (* = marked no-connect by the designer): U26 15(VLXSMPS)*

### Notes on the sheet
- VDDLDO
- Between USB30 USB50
- (near C192) For VBat
- Project:
- Sub-system:
- Design by:
- Sheet title:
- Sheet
- A3
- of
- Checked by:
- Approved by:
- Revision:
- Document No:
- Size:
- Date:
- (in symbol TACL335M003RTA) +
- (in symbol TACR686M003RTA) +

### Library data of the parts
C180-C182 C185 C188-C190 C193 = Tu 0402 33nF 10V: 4.7 µF ±20% 6.3V Ceramic Capacitor X7T 0402 (1005 Metric): GRT155D70J475ME13J; Chung_Loai: Dán; Don_Vi: Con; So_Chan: 2; Ten_Linh_Kien: Tụ 0402 33nF X7R 10V GRM155R71A333KA01D; Ma_Hang: MH007853; Kieu_Chan: *
C183 C184 C191 C192 C194-C206 C208-C220 = Tu 0402 33nF 10V: as C148-C159 on sheet obc-v2_CM4-IRQ-CTRL; Kieu_Chan: *
C186 C187 = TACL335M003RTA: CAPP; Package: None; Price: None; Value: *; MP: TACL335M003RTA; Availability: Unavailable
C207 = TACR686M003RTA: CAPP; MF: AVX; Availability: Unavailable; SnapEDA_Link: https://www.snapeda.com/parts/TACR686M003RTA/AVX/view-part/1745975/?ref=snap; MP: TACR686M003RTA; Value: *; Price: None; Package: 0805 AVX
R88 R89 = Tro 0603 1% 10k: as R71-R80 on sheet obc-v2_CM4-IRQ-CTRL; Kieu_Chan: *
U26 = CMP-12105-000054-1: HIGH-PERFORMANCE AND DSP WITH DP; Manufacturer Part Number: STM32H745ZIT6; Manufacturer: STMicroelectronics; Number Of Timers/Counters: 20; Min Supply Voltage: 1.62V; Frequency: 480MHz; Number Of I2C Channels: 4; Memory Type: FLASH; Number Of I/Os: 97; Number Of Pwm Channels: 42; Number Of Usb Channels: 2; Ram Size: 1MBytes; Memory Size: 2MBytes; Data Bus Width: 32bits; Number Of Adc Channels: 23; Number Of Ethernet Channels: 1; Number Of Uart Channels: 9; Interface: I2C,SPI,UART,USART,CAN,USB,LIN,IrDA,Ethernet,I2S,Other; Number Of A/D Converters: 3; Max Junction Temp: +125°C; Max Supply Voltage: 3.6V; Core Architecture: ARM Cortex-M4, Cortex-M7; Number Of Spi Channels: 6; Standoff Height: 0.05mm; Ambient Temperature Range Low: -40°C; Lead Free: Yes; Automotive: No; Height: 1.6mm; Device Class L1: Integrated Circuits (ICs); Ambient Temperature Range High: +85°C; RoHS: TRUE; Temperature Range High: +125°C; Temperature: -40°C to +125°C; Category: IC; Device Class L2: Embedded Processors and Controllers; Number Of Cores: 2; Temperature Range Low: -40°C; Octopart: https://octopart.com/stm32h745zit6-stmicroelectronics-100293939; Digikey Description: HIGH-PERFORMANCE AND DSP WITH DP; Package: LQFP144-1A; Device Class L3: Microcontrollers; ComponentLink2URL: https://www.st.com/resource/en/datasheet/stm32h745zi.pdf; ComponentLink2Description: Datasheet

## Sheet obc-v2_MCU-PinOut.SchDoc
size 420 x 297 mm; SheetNumber: 21; SheetTotal: 21
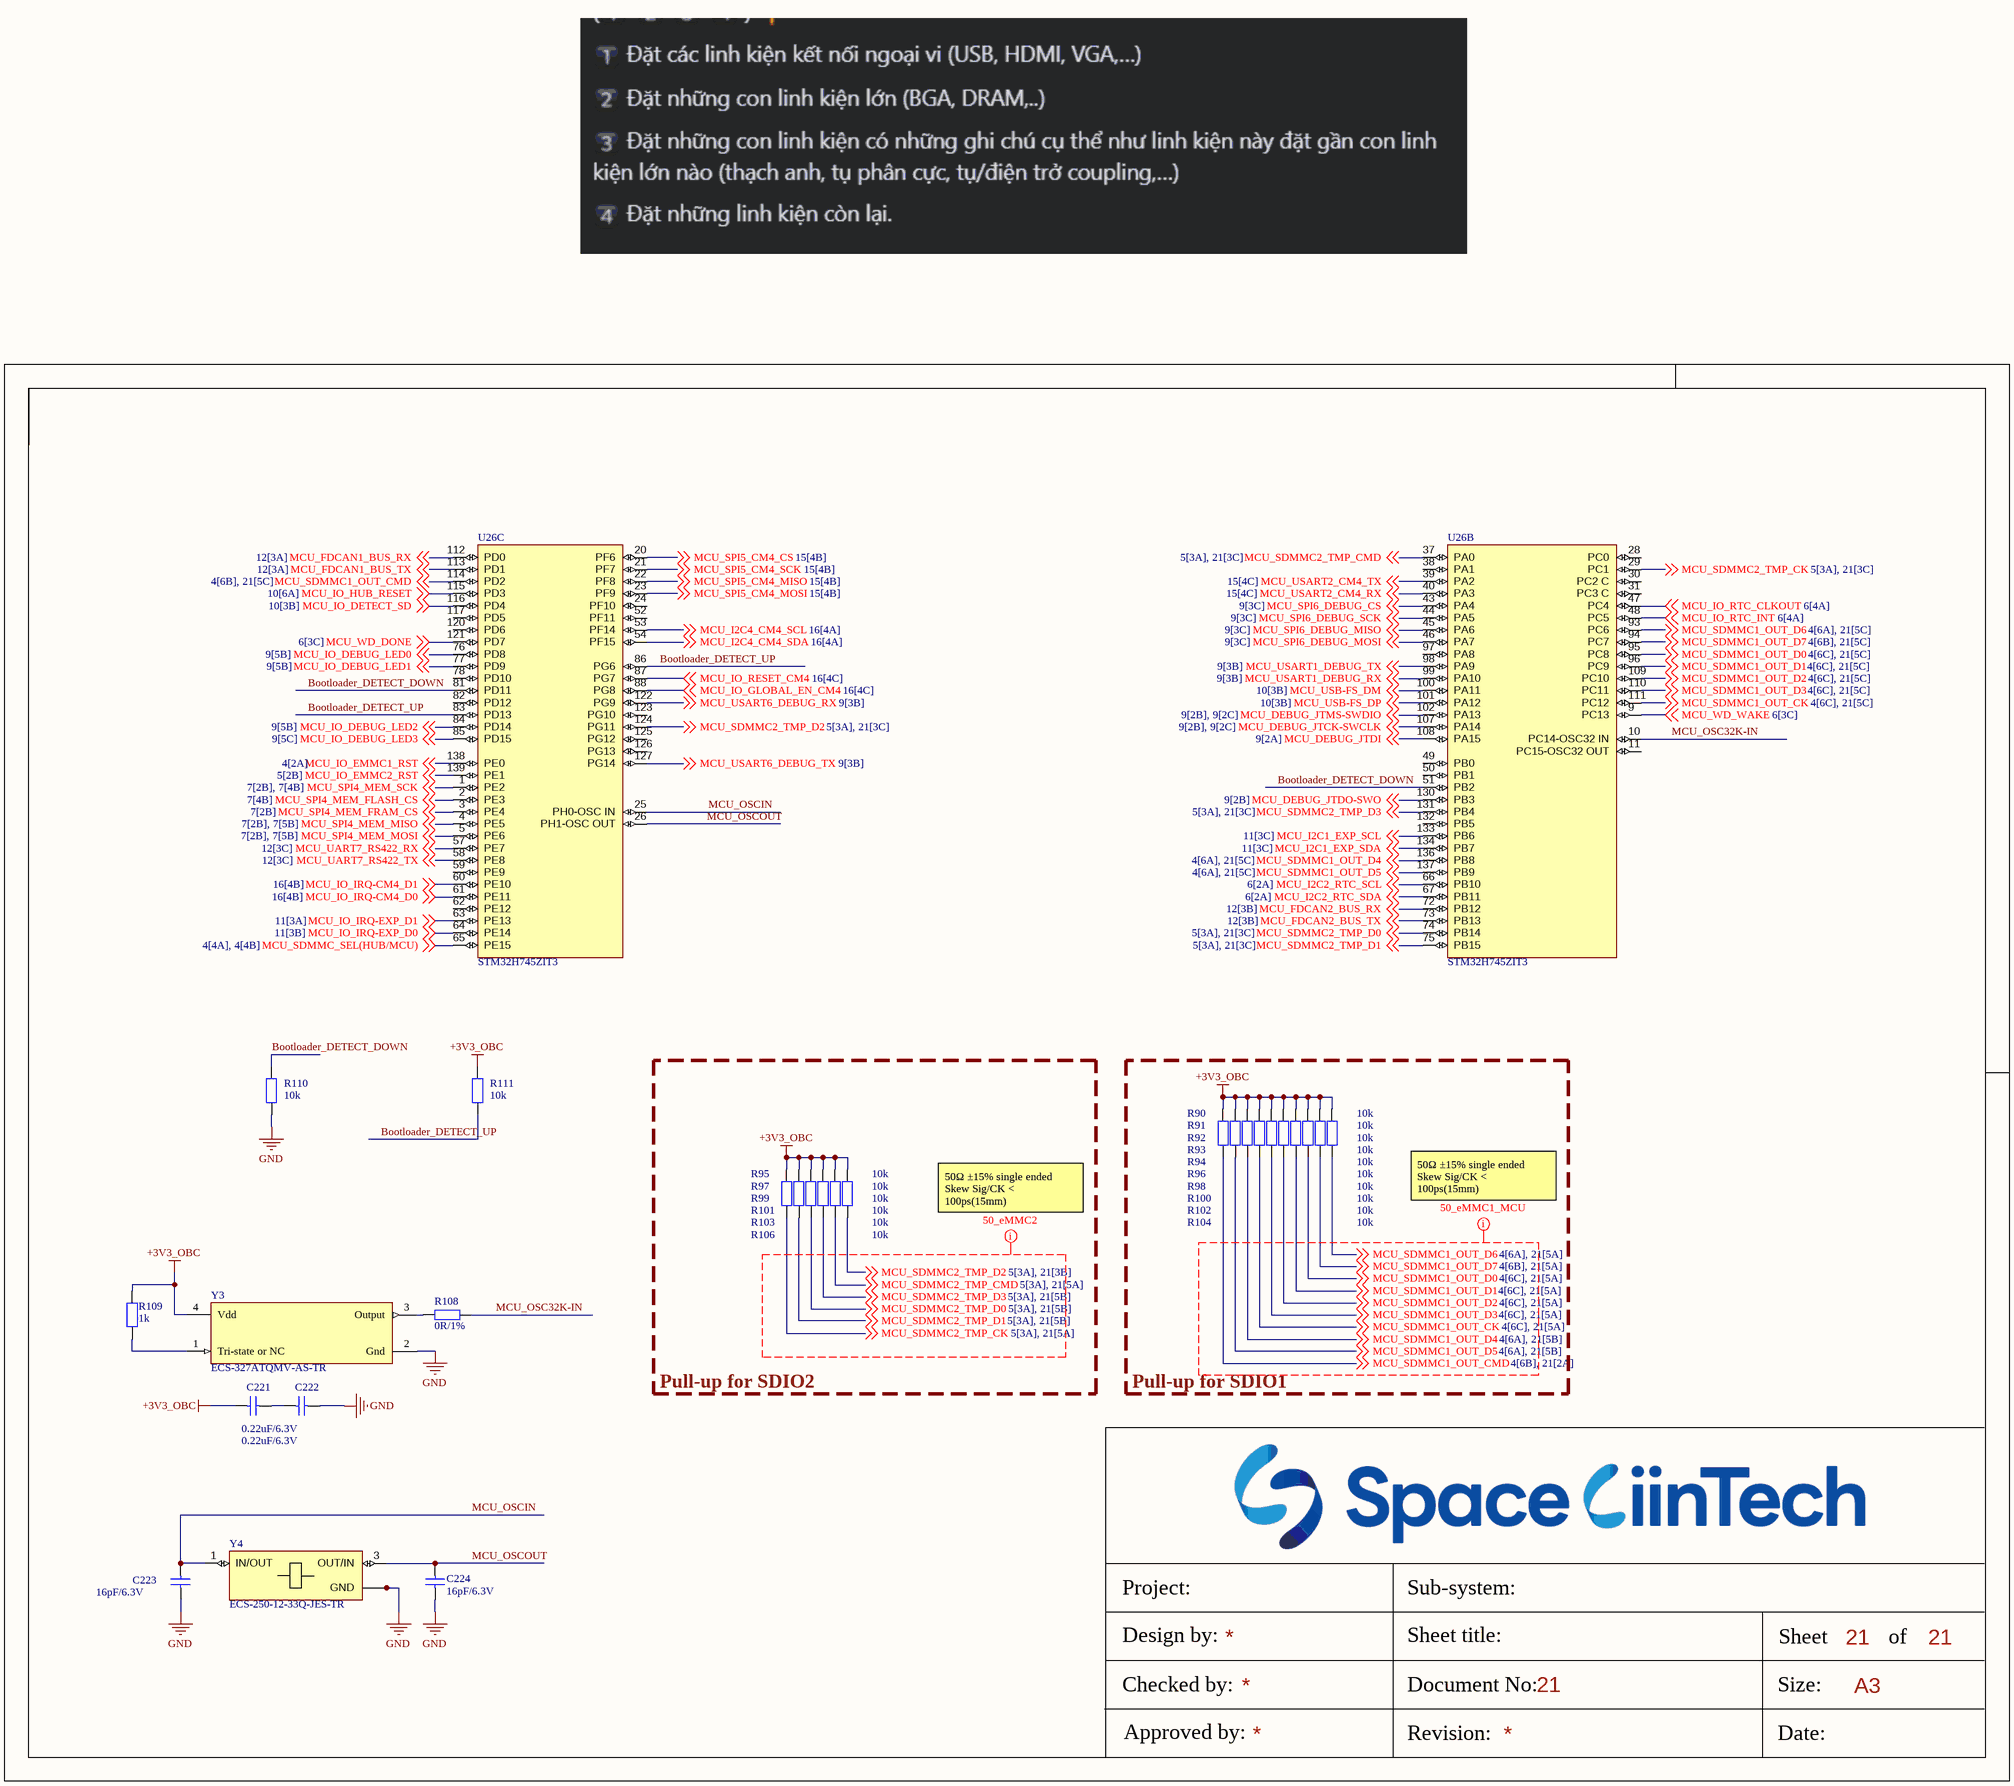
[diagram p22: obc-v2_MCU-PinOut.SchDoc]

### Parts
C221  0.22uF/6.3V  [CAP_C_1005X60]
C222  0.22uF/6.3V  [CAP_C_1005X60]
C223  16pF/6.3V  [CAP_C_1005X60]
C224  16pF/6.3V  [CAP_C_1005X60]
R90  10k  [RES_C_1608X60]
R91  10k  [RES_C_1608X60]
R92  10k  [RES_C_1608X60]
R93  10k  [RES_C_1608X60]
R94  10k  [RES_C_1608X60]
R95  10k  [RES_C_1608X60]
R96  10k  [RES_C_1608X60]
R97  10k  [RES_C_1608X60]
R98  10k  [RES_C_1608X60]
R99  10k  [RES_C_1608X60]
R100  10k  [RES_C_1608X60]
R101  10k  [RES_C_1608X60]
R102  10k  [RES_C_1608X60]
R103  10k  [RES_C_1608X60]
R104  10k  [RES_C_1608X60]
R106  10k  [RES_C_1608X60]
R108  0R/1%  [RES_C_1608X60]
R109  1k  [RES_C_1608X60]
R110  10k  [RES_C_1608X60]
R111  10k  [RES_C_1608X60]
U26  STM32H745ZIT3  [FP-LQFP144-1A-MFG]  (parts B,C of 3)
Y3  ECS-327ATQMV-AS-TR  [FP-327ATQMV-MFG]
Y4  ECS-250-12-33Q-JES-TR  [XTAL_ECS-250-12-33Q-JES-TR]

### Blocks framed on the sheet
Pull-up for SDIO2: R95 R97 R99 R101 R103 R106
Pull-up for SDIO1: R90-R94 R96 R98 R100 R102 R104

### Nets
+3V3_OBC: C221.1 R90.2 R91.2 R92.2 R93.2 R94.2 R95.2 R96.2 R97.2 R98.2 R99.2 R100.2 R101.2 R102.2 R103.2 R104.2 R106.2 R109.1 R111.2 Y3.4(Vdd)
GND: C222.2 C223.1 C224.1 R110.1 Y3.2(Gnd) Y4.2(GND) Y4.4(GND)
Bootloader_DETECT_DOWN: R110.2 U26.51(PB2) U26.81(PD11)
Bootloader_DETECT_UP: R111.1 U26.83(PD13) U26.86(PG6)
MCU_DEBUG_JTCK-SWCLK: U26.107(PA14) ; off-sheet MCU_DEBUG_JTCK-SWCLK
MCU_DEBUG_JTDI: U26.108(PA15) ; off-sheet MCU_DEBUG_JTDI
MCU_DEBUG_JTDO-SWO: U26.130(PB3) ; off-sheet MCU_DEBUG_JTDO-SWO
MCU_DEBUG_JTMS-SWDIO: U26.102(PA13) ; off-sheet MCU_DEBUG_JTMS-SWDIO
MCU_FDCAN1_BUS_RX: U26.112(PD0) ; off-sheet MCU_FDCAN1_BUS_RX
MCU_FDCAN1_BUS_TX: U26.113(PD1) ; off-sheet MCU_FDCAN1_BUS_TX
MCU_FDCAN2_BUS_RX: U26.72(PB12) ; off-sheet MCU_FDCAN2_BUS_RX
MCU_FDCAN2_BUS_TX: U26.73(PB13) ; off-sheet MCU_FDCAN2_BUS_TX
MCU_I2C1_EXP_SCL: U26.133(PB6) ; off-sheet MCU_I2C1_EXP_SCL
MCU_I2C1_EXP_SDA: U26.134(PB7) ; off-sheet MCU_I2C1_EXP_SDA
MCU_I2C2_RTC_SCL: U26.66(PB10) ; off-sheet MCU_I2C2_RTC_SCL
MCU_I2C2_RTC_SDA: U26.67(PB11) ; off-sheet MCU_I2C2_RTC_SDA
MCU_I2C4_CM4_SCL: U26.53(PF14) ; off-sheet MCU_I2C4_CM4_SCL
MCU_I2C4_CM4_SDA: U26.54(PF15) ; off-sheet MCU_I2C4_CM4_SDA
MCU_IO_DEBUG_LED0: U26.76(PD8) ; off-sheet MCU_IO_DEBUG_LED0
MCU_IO_DEBUG_LED1: U26.77(PD9) ; off-sheet MCU_IO_DEBUG_LED1
MCU_IO_DEBUG_LED2: U26.84(PD14) ; off-sheet MCU_IO_DEBUG_LED2
MCU_IO_DEBUG_LED3: U26.85(PD15) ; off-sheet MCU_IO_DEBUG_LED3
MCU_IO_DETECT_SD: U26.116(PD4) ; off-sheet MCU_IO_DETECT_SD  [project net MCU_DETECT_SD]
MCU_IO_EMMC1_RST: U26.138(PE0) ; off-sheet MCU_IO_EMMC1_RST  [project net EMMC1_RST]
MCU_IO_EMMC2_RST: U26.139(PE1) ; off-sheet MCU_IO_EMMC2_RST  [project net EMMC2_RST]
MCU_IO_GLOBAL_EN_CM4: U26.88(PG8) ; off-sheet MCU_IO_GLOBAL_EN_CM4
MCU_IO_HUB_RESET: U26.115(PD3) ; off-sheet MCU_IO_HUB_RESET
MCU_IO_IRQ-CM4_D0: U26.61(PE11) ; off-sheet MCU_IO_IRQ-CM4_D0
MCU_IO_IRQ-CM4_D1: U26.60(PE10) ; off-sheet MCU_IO_IRQ-CM4_D1
MCU_IO_IRQ-EXP_D0: U26.64(PE14) ; off-sheet MCU_IO_IRQ-EXP_D0
MCU_IO_IRQ-EXP_D1: U26.63(PE13) ; off-sheet MCU_IO_IRQ-EXP_D1
MCU_IO_RESET_CM4: U26.87(PG7) ; off-sheet MCU_IO_RESET_CM4
MCU_IO_RTC_CLKOUT: U26.47(PC4) ; off-sheet MCU_IO_RTC_CLKOUT
MCU_IO_RTC_INT: U26.48(PC5) ; off-sheet MCU_IO_RTC_INT
MCU_OSC32K-IN: R108.1 U26.10(PC14-OSC32_IN)
MCU_OSCIN: C223.2 U26.25(PH0-OSC_IN) Y4.1(IN/OUT)
MCU_OSCOUT: C224.2 U26.26(PH1-OSC_OUT) Y4.3(OUT/IN)
MCU_SDMMC1_OUT_CK: R93.1 U26.111(PC12) ; off-sheet MCU_SDMMC1_OUT_CK
MCU_SDMMC1_OUT_CMD: R90.1 U26.114(PD2) ; off-sheet MCU_SDMMC1_OUT_CMD
MCU_SDMMC1_OUT_D0: R100.1 U26.95(PC8) ; off-sheet MCU_SDMMC1_OUT_D0
MCU_SDMMC1_OUT_D1: R98.1 U26.96(PC9) ; off-sheet MCU_SDMMC1_OUT_D1
MCU_SDMMC1_OUT_D2: R96.1 U26.109(PC10) ; off-sheet MCU_SDMMC1_OUT_D2
MCU_SDMMC1_OUT_D3: R94.1 U26.110(PC11) ; off-sheet MCU_SDMMC1_OUT_D3
MCU_SDMMC1_OUT_D4: R92.1 U26.136(PB8) ; off-sheet MCU_SDMMC1_OUT_D4
MCU_SDMMC1_OUT_D5: R91.1 U26.137(PB9) ; off-sheet MCU_SDMMC1_OUT_D5
MCU_SDMMC1_OUT_D6: R104.1 U26.93(PC6) ; off-sheet MCU_SDMMC1_OUT_D6
MCU_SDMMC1_OUT_D7: R102.1 U26.94(PC7) ; off-sheet MCU_SDMMC1_OUT_D7
MCU_SDMMC2_TMP_CK: R95.1 U26.29(PC1) ; off-sheet MCU_SDMMC2_TMP_CK  [project net EMMC2_CLK]
MCU_SDMMC2_TMP_CMD: R103.1 U26.37(PA0) ; off-sheet MCU_SDMMC2_TMP_CMD  [project net EMMC2_CMD]
MCU_SDMMC2_TMP_D0: R99.1 U26.74(PB14) ; off-sheet MCU_SDMMC2_TMP_D0  [project net EMMC2_DAT0]
MCU_SDMMC2_TMP_D1: R97.1 U26.75(PB15) ; off-sheet MCU_SDMMC2_TMP_D1  [project net EMMC2_DAT1]
MCU_SDMMC2_TMP_D2: R106.1 U26.124(PG11) ; off-sheet MCU_SDMMC2_TMP_D2  [project net EMMC2_DAT2]
MCU_SDMMC2_TMP_D3: R101.1 U26.131(PB4) ; off-sheet MCU_SDMMC2_TMP_D3  [project net EMMC2_DAT3]
MCU_SDMMC_SEL(HUB/MCU): U26.65(PE15) ; off-sheet MCU_SDMMC_SEL(HUB/MCU)
MCU_SPI4_MEM_FLASH_CS: U26.2(PE3) ; off-sheet MCU_SPI4_MEM_FLASH_CS
MCU_SPI4_MEM_FRAM_CS: U26.3(PE4) ; off-sheet MCU_SPI4_MEM_FRAM_CS
MCU_SPI4_MEM_MISO: U26.4(PE5) ; off-sheet MCU_SPI4_MEM_MISO
MCU_SPI4_MEM_MOSI: U26.5(PE6) ; off-sheet MCU_SPI4_MEM_MOSI
MCU_SPI4_MEM_SCK: U26.1(PE2) ; off-sheet MCU_SPI4_MEM_SCK
MCU_SPI5_CM4_CS: U26.20(PF6) ; off-sheet MCU_SPI5_CM4_CS
MCU_SPI5_CM4_MISO: U26.22(PF8) ; off-sheet MCU_SPI5_CM4_MISO
MCU_SPI5_CM4_MOSI: U26.23(PF9) ; off-sheet MCU_SPI5_CM4_MOSI
MCU_SPI5_CM4_SCK: U26.21(PF7) ; off-sheet MCU_SPI5_CM4_SCK
MCU_SPI6_DEBUG_CS: U26.43(PA4) ; off-sheet MCU_SPI6_DEBUG_CS
MCU_SPI6_DEBUG_MISO: U26.45(PA6) ; off-sheet MCU_SPI6_DEBUG_MISO
MCU_SPI6_DEBUG_MOSI: U26.46(PA7) ; off-sheet MCU_SPI6_DEBUG_MOSI
MCU_SPI6_DEBUG_SCK: U26.44(PA5) ; off-sheet MCU_SPI6_DEBUG_SCK
MCU_UART7_RS422_RX: U26.57(PE7) ; off-sheet MCU_UART7_RS422_RX  [project net MCU_RS422_RX]
MCU_UART7_RS422_TX: U26.58(PE8) ; off-sheet MCU_UART7_RS422_TX  [project net MCU_RS422_TX]
MCU_USART1_DEBUG_RX: U26.99(PA10) ; off-sheet MCU_USART1_DEBUG_RX
MCU_USART1_DEBUG_TX: U26.98(PA9) ; off-sheet MCU_USART1_DEBUG_TX
MCU_USART2_CM4_RX: U26.40(PA3) ; off-sheet MCU_USART2_CM4_RX
MCU_USART2_CM4_TX: U26.39(PA2) ; off-sheet MCU_USART2_CM4_TX
MCU_USART6_DEBUG_RX: U26.122(PG9) ; off-sheet MCU_USART6_DEBUG_RX
MCU_USART6_DEBUG_TX: U26.127(PG14) ; off-sheet MCU_USART6_DEBUG_TX
MCU_USB-FS_DM: U26.100(PA11) ; off-sheet MCU_USB-FS_DM  [project net MCU_USB-FS_HUB_D_N]
MCU_USB-FS_DP: U26.101(PA12) ; off-sheet MCU_USB-FS_DP  [project net MCU_USB-FS_HUB_D_P]
MCU_WD_DONE: U26.121(PD7) ; off-sheet MCU_WD_DONE
MCU_WD_WAKE: U26.9(PC13) ; off-sheet MCU_WD_WAKE
NetC221_2: C221.2 C222.1
NetR108_2: R108.2 Y3.3(Output)
NetR109_2: R109.2 Y3.1(Tri-state_or_NC)

Not connected (* = marked no-connect by the designer): U26 11(PC15-OSC32_OUT) 24(PF10) 28(PC0) 30(PC2_C) 31(PC3_C) 38(PA1) 49(PB0) 50(PB1) 52(PF11) 59(PE9) 62(PE12) 78(PD10) 82(PD12) 97(PA8) 117(PD5) 120(PD6) 123(PG10) 125(PG12) 126(PG13) 132(PB5)

### Layout directives
net class 50_eMMC1_MCU: MCU_SDMMC1_OUT_CK, MCU_SDMMC1_OUT_CMD, MCU_SDMMC1_OUT_D0, MCU_SDMMC1_OUT_D1, MCU_SDMMC1_OUT_D2, MCU_SDMMC1_OUT_D3, MCU_SDMMC1_OUT_D4, MCU_SDMMC1_OUT_D5, MCU_SDMMC1_OUT_D6, MCU_SDMMC1_OUT_D7
net class 50_eMMC2: MCU_SDMMC2_TMP_CK, MCU_SDMMC2_TMP_CMD, MCU_SDMMC2_TMP_D0, MCU_SDMMC2_TMP_D1, MCU_SDMMC2_TMP_D2, MCU_SDMMC2_TMP_D3

### Notes on the sheet
- 50Ω ±15% single ended
  Skew Sig/CK < 100ps(15mm)
  Max Length 100mm
- Project:
- Sub-system:
- Design by:
- Sheet title:
- Sheet
- A3
- of
- Checked by:
- Approved by:
- Revision:
- Document No:
- Size:
- Date:

### Library data of the parts
C221-C224 = Tu 0402 33nF 10V: as C148-C159 on sheet obc-v2_CM4-IRQ-CTRL; Kieu_Chan: *
R90-R104 R106 R110 R111 = Tro 0603 1% 10k: RES 4.7K OHM 1% 1/10W 0603, P/N: ERJ-U03F4701V; Chung_Loai: Dán; Don_Vi: Con; So_Chan: 2; Ten_Linh_Kien: Trở 0603 1% 10k; Ma_Hang: MH006333; Kieu_Chan: *
R108 R109 = Tro 0603 1% 10k: as R71-R80 on sheet obc-v2_CM4-IRQ-CTRL; Kieu_Chan: *
U26 = CMP-12105-000054-1: as U26 on sheet obc-v2_MCU-POWER; Ambient Temperature Range Low: -40°C; Lead Free: Yes; Automotive: No; Height: 1.6mm; Device Class L1: Integrated Circuits (ICs); Ambient Temperature Range High: +85°C; RoHS: TRUE; Temperature Range High: +125°C; Temperature: -40°C to +125°C; Category: IC; Device Class L2: Embedded Processors and Controllers; Number Of Cores: 2; Temperature Range Low: -40°C; Octopart: https://octopart.com/stm32h745zit6-stmicroelectronics-100293939; Digikey Description: HIGH-PERFORMANCE AND DSP WITH DP; Package: LQFP144-1A; Device Class L3: Microcontrollers; ComponentLink2URL: https://www.st.com/resource/en/datasheet/stm32h745zi.pdf; ComponentLink2Description: Datasheet
Y3 = CMP-40224-000027-1: XTAL OSC XO 32.7680KHZ CMOS SMD; RoHS Compliant: Yes
Y4 = ECS-250-12-33Q-JES-TR: 25 MHz Â±20ppm Crystal 12pF 40 Ohms 4-SMD, No Lead; MF: ECS Inc.; Value: *; Purchase-URL: https://pricing.snapeda.com/search/part/ECS-250-12-33Q-JES-TR/?ref=eda; Package: ECS-33B ECS Inc.; Availability: In Stock; SnapEDA_Link: https://www.snapeda.com/parts/ECS-250-12-33Q-JES-TR/ECS+Inc./view-part/?ref=snap; MP: ECS-250-12-33Q-JES-TR; Check_prices: https://www.snapeda.com/parts/ECS-250-12-33Q-JES-TR/ECS+Inc./view-part/?ref=eda; Price: None